# Altium project GrippersTorpedoModule_V1_OKON.PrjPCB
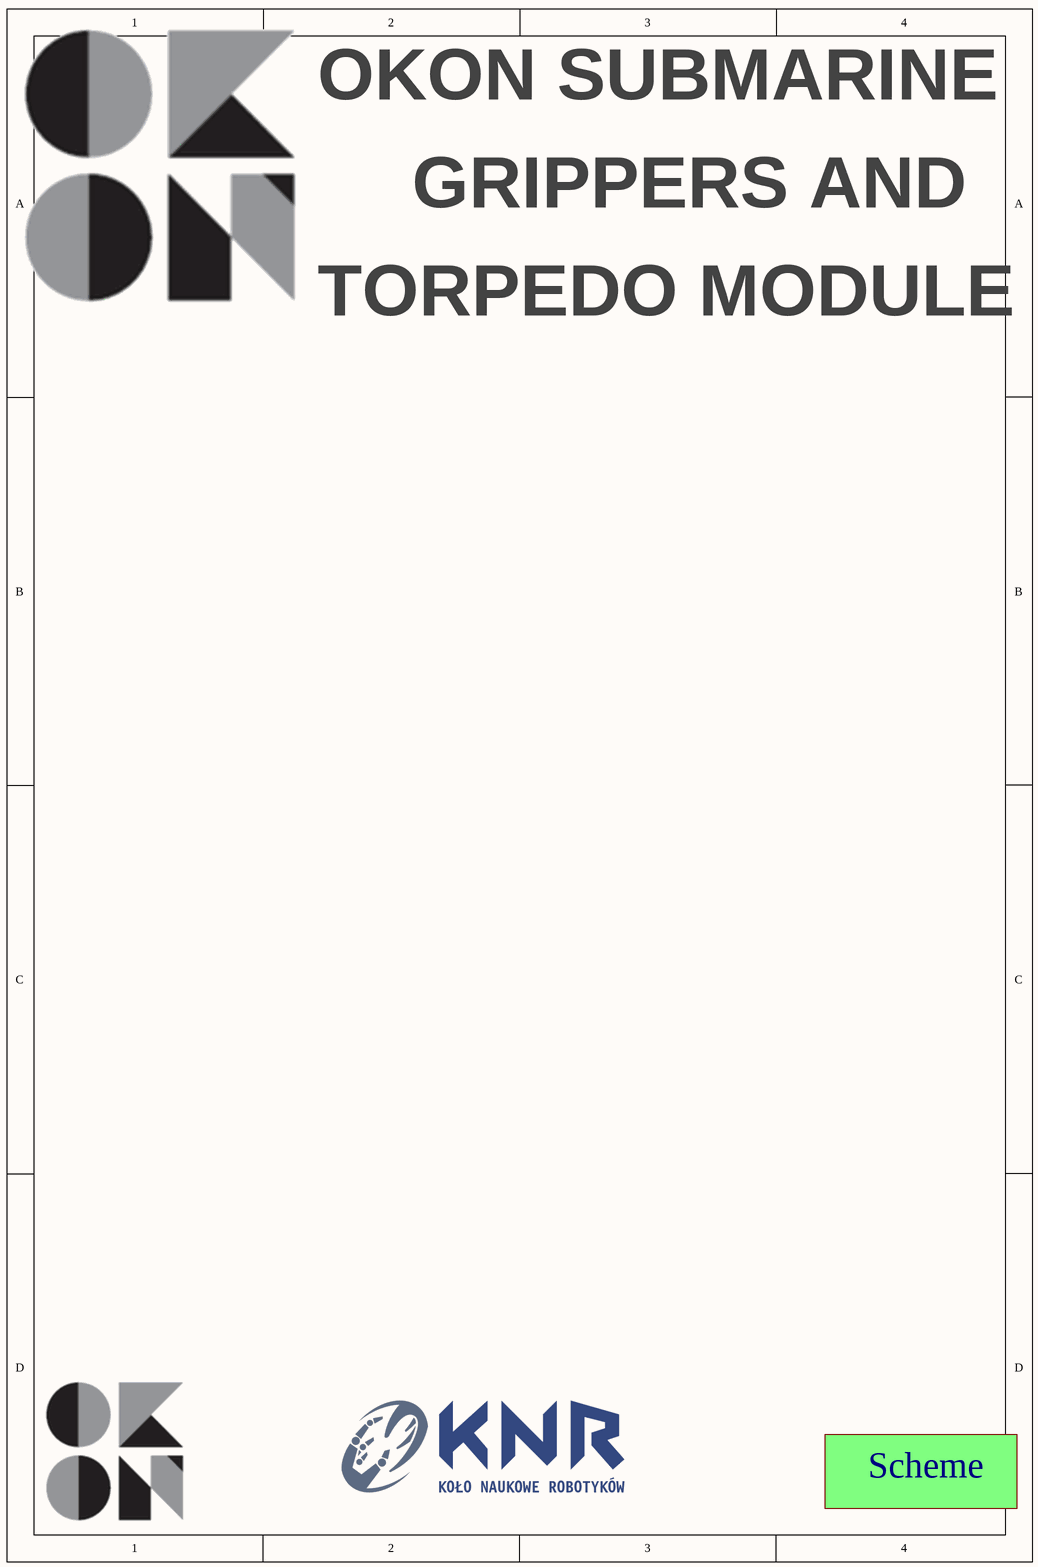
[diagram p0: GTM_OKON.SchDoc]
20 sheets, 150 parts. Net scope: flat (ports and power ports of the same name join across sheets).
Sheets:
  GTM_OKON.SchDoc
    Designator = GTM_Connectors.SchDoc
      Main Board = GTM_MainBoard.SchDoc
        MCU = GTM_MCU.SchDoc
        Controled LEDs = GTM_MCUcontrolledLEDs.SchDoc
        Fototransistor's  Circuits = GTM_BallGrippersCircuits.SchDoc
      Left Jaw Gripper = GTM_LeftJawGrippersMotorsConnectors.SchDoc
      Right Jaw Gripper = GTM_RightJawGrippersMotorConnector.SchDoc
      Torpedo = GTM_TorpedoModuleControlConnector.SchDoc
      Power Circuits(LDO) = GTM_PowerCircuits.SchDoc
      Fototransistors Connectors = GTM_BallGrippersFototransistorsConnectors.SchDoc
      Fotodiodes Connectors = GTM_BallGrippersDiodesConnectors.SchDoc
      Ball Gripper Motor Connector = GTM_BallGrippersMotorConnector.SchDoc
      UART = GTM_UARTconnector.SchDoc
      CAN = GTM_CANconnector.SchDoc
      I2C = GTM_I2Cconnector.SchDoc
      SPI = GTM_SPIconnector.SchDoc
      Free Pins = GTM_FreePinsHeaders.SchDoc
      Programming = GTM_ProgrammingConnector.SchDoc
      Power Connector = GTM_PowerConnector.SchDoc

## Sheet GTM_OKON.SchDoc: Wprowadź Tytuł
size 193 x 292 mm; CheckedBy: Wprowadź sprawdzającego; DrawnBy: Wprowadź autora; Organization: Koło Naukowe Robotyków; Address1: Nowowiejska 24; Address2: 00-001; Address3: Wraszawa; Address4: Polska; Revision: Numer; Nazwa Arkusza: Wpisz nazwę arkusza; ProjectName: Nazwa Projektu

### Sub-sheets
Designator = GTM_Connectors.SchDoc: no entries

### Notes on the sheet
- OKON SUBMARINE
- GRIPPERS AND
- TORPEDO MODULE
- Scheme
- Title
- Size:
- Date:
- A4
- Number:
- Time:
- Revision:
- Sheet
- of
- File:

## Sheet GTM_Connectors.SchDoc: GTM Scheme
size A4; CompanyName: Koło Naukowe Robotyków; DrawnBy: Tadeusz Golczyk; Address1: Nowowiejska 24; Address2: 00-001; Address3: Warszawa; DocumentNumber: 1
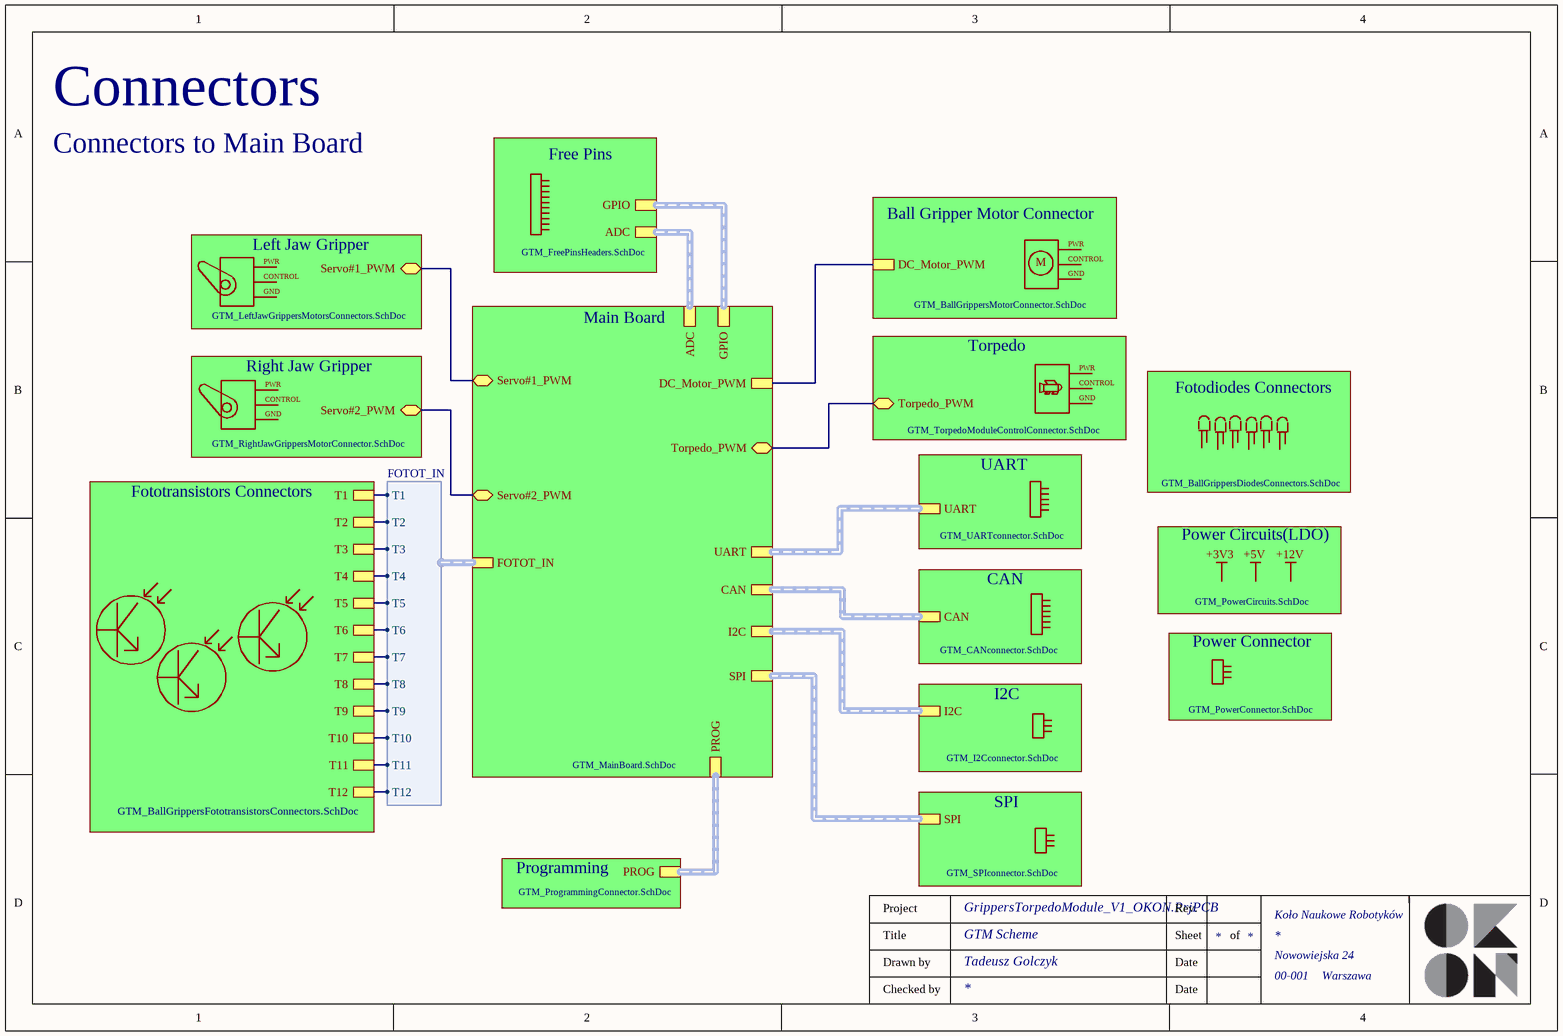
[diagram p1: GTM_Connectors.SchDoc]

### Sub-sheets
Ball Gripper Motor Connector = GTM_BallGrippersMotorConnector.SchDoc: DC_Motor_PWM
CAN = GTM_CANconnector.SchDoc: CAN
Fotodiodes Connectors = GTM_BallGrippersDiodesConnectors.SchDoc: no entries
Fototransistors Connectors = GTM_BallGrippersFototransistorsConnectors.SchDoc: T1, T2, T3, T4, T5, T6, T7, T8, T9, T10, T11, T12
Free Pins = GTM_FreePinsHeaders.SchDoc: ADC, GPIO
I2C = GTM_I2Cconnector.SchDoc: I2C
Left Jaw Gripper = GTM_LeftJawGrippersMotorsConnectors.SchDoc: Servo#1_PWM (bidir)
Main Board = GTM_MainBoard.SchDoc: FOTOT_IN (harness FOTOT_IN), Servo#2_PWM (bidir), Servo#1_PWM (bidir), ADC, GPIO, PROG, DC_Motor_PWM, Torpedo_PWM (bidir), UART, CAN, I2C, SPI
Power Circuits(LDO) = GTM_PowerCircuits.SchDoc: no entries
Power Connector = GTM_PowerConnector.SchDoc: no entries
Programming = GTM_ProgrammingConnector.SchDoc: PROG
Right Jaw Gripper = GTM_RightJawGrippersMotorConnector.SchDoc: Servo#2_PWM (bidir)
SPI = GTM_SPIconnector.SchDoc: SPI
Torpedo = GTM_TorpedoModuleControlConnector.SchDoc: Torpedo_PWM (bidir)
UART = GTM_UARTconnector.SchDoc: UART

### Harnesses
FOTOT_IN: T1, T2, T3, T4, T5, T6, T7, T8, T9, T10, T11, T12

### Nets
(unnamed): sheet Main Board/Servo#2_PWM, sheet Right Jaw Gripper/Servo#2_PWM
(unnamed): sheet Main Board/Servo#1_PWM, sheet Left Jaw Gripper/Servo#1_PWM
(unnamed): sheet Main Board/DC_Motor_PWM, sheet Ball Gripper Motor Connector/DC_Motor_PWM
(unnamed): sheet Main Board/Torpedo_PWM, sheet Torpedo/Torpedo_PWM
(unnamed): sheet Fototransistors Connectors/T1, sheet Main Board/FOTOT_IN.T1
(unnamed): sheet Fototransistors Connectors/T2, sheet Main Board/FOTOT_IN.T2
(unnamed): sheet Fototransistors Connectors/T3, sheet Main Board/FOTOT_IN.T3
(unnamed): sheet Fototransistors Connectors/T4, sheet Main Board/FOTOT_IN.T4
(unnamed): sheet Fototransistors Connectors/T5, sheet Main Board/FOTOT_IN.T5
(unnamed): sheet Fototransistors Connectors/T6, sheet Main Board/FOTOT_IN.T6
(unnamed): sheet Fototransistors Connectors/T7, sheet Main Board/FOTOT_IN.T7
(unnamed): sheet Fototransistors Connectors/T8, sheet Main Board/FOTOT_IN.T8
(unnamed): sheet Fototransistors Connectors/T9, sheet Main Board/FOTOT_IN.T9
(unnamed): sheet Fototransistors Connectors/T10, sheet Main Board/FOTOT_IN.T10
(unnamed): sheet Fototransistors Connectors/T11, sheet Main Board/FOTOT_IN.T11
(unnamed): sheet Fototransistors Connectors/T12, sheet Main Board/FOTOT_IN.T12

### Buses and harness runs
harness sheet CAN/CAN = sheet Main Board/CAN
harness sheet Free Pins/ADC = sheet Main Board/ADC
harness sheet Free Pins/GPIO = sheet Main Board/GPIO
harness sheet I2C/I2C = sheet Main Board/I2C
harness sheet Main Board/PROG = sheet Programming/PROG
harness sheet Main Board/SPI = sheet SPI/SPI
harness sheet Main Board/UART = sheet UART/UART

### Notes on the sheet
- Connectors
- Connectors to Main Board
- PWR
- CONTROL
- GND
- M
- +3V3
- +5V
- +12V
- Project
- Rev.
- Title
- Drawn by
- Date
- Sheet
- of
- Checked by

## Sheet GTM_MainBoard.SchDoc
size A4
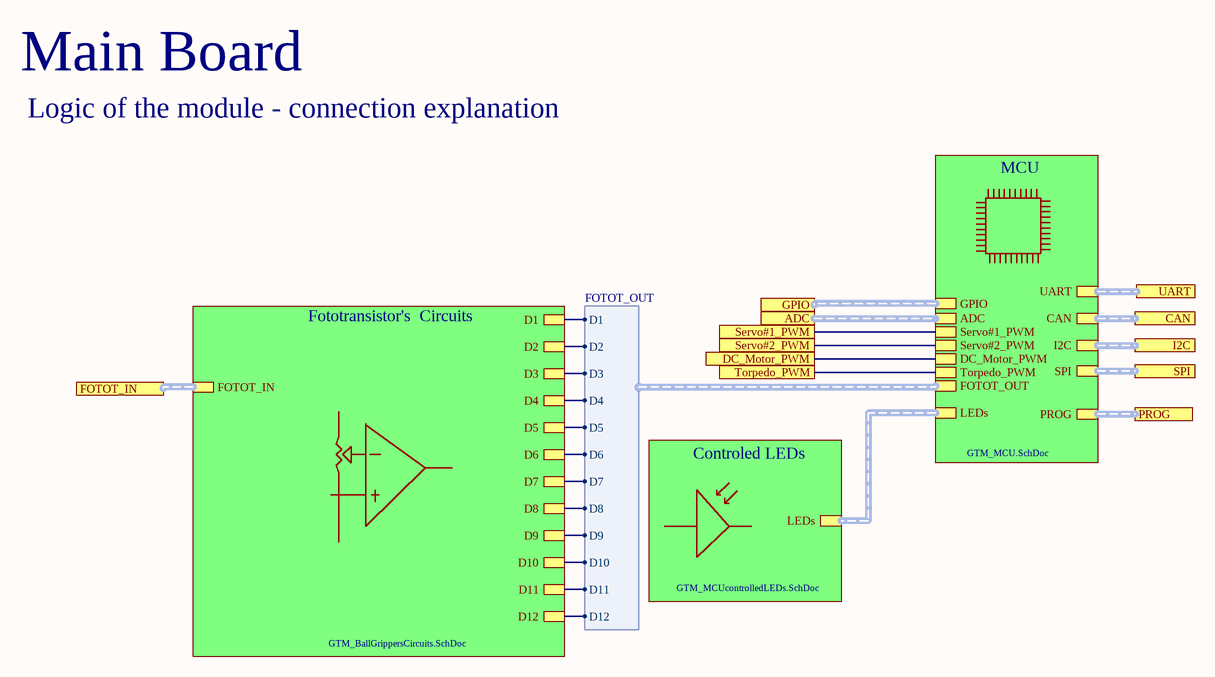
[diagram p2: GTM_MainBoard.SchDoc]

### Sub-sheets
Controled LEDs = GTM_MCUcontrolledLEDs.SchDoc: LEDs
Fototransistor's  Circuits = GTM_BallGrippersCircuits.SchDoc: FOTOT_IN (harness Harness), D1, D2, D3, D4, D5, D6, D7, D8, D9, D10, D11, D12
MCU = GTM_MCU.SchDoc: ADC, GPIO, UART, CAN, I2C, SPI, PROG, LEDs, Servo#1_PWM, Servo#2_PWM, DC_Motor_PWM, Torpedo_PWM, FOTOT_OUT (harness FOTOT_OUT)

### Ports
ADC, CAN, DC_Motor_PWM, FOTOT_IN, GPIO, I2C, PROG, Servo#1_PWM, Servo#2_PWM, SPI, Torpedo_PWM, UART

### Harnesses
FOTOT_OUT: D1, D2, D3, D4, D5, D6, D7, D8, D9, D10, D11, D12

### Nets
DC_Motor_PWM: port DC_Motor_PWM, sheet MCU/DC_Motor_PWM
Servo#1_PWM: port Servo#1_PWM, sheet MCU/Servo#1_PWM
Servo#2_PWM: port Servo#2_PWM, sheet MCU/Servo#2_PWM
Torpedo_PWM: port Torpedo_PWM, sheet MCU/Torpedo_PWM
(unnamed): sheet Fototransistor's  Circuits/D1, sheet MCU/FOTOT_OUT.D1
(unnamed): sheet Fototransistor's  Circuits/D2, sheet MCU/FOTOT_OUT.D2
(unnamed): sheet Fototransistor's  Circuits/D3, sheet MCU/FOTOT_OUT.D3
(unnamed): sheet Fototransistor's  Circuits/D4, sheet MCU/FOTOT_OUT.D4
(unnamed): sheet Fototransistor's  Circuits/D5, sheet MCU/FOTOT_OUT.D5
(unnamed): sheet Fototransistor's  Circuits/D6, sheet MCU/FOTOT_OUT.D6
(unnamed): sheet Fototransistor's  Circuits/D7, sheet MCU/FOTOT_OUT.D7
(unnamed): sheet Fototransistor's  Circuits/D8, sheet MCU/FOTOT_OUT.D8
(unnamed): sheet Fototransistor's  Circuits/D9, sheet MCU/FOTOT_OUT.D9
(unnamed): sheet Fototransistor's  Circuits/D10, sheet MCU/FOTOT_OUT.D10
(unnamed): sheet Fototransistor's  Circuits/D11, sheet MCU/FOTOT_OUT.D11
(unnamed): sheet Fototransistor's  Circuits/D12, sheet MCU/FOTOT_OUT.D12

### Buses and harness runs
harness port ADC = sheet MCU/ADC
harness port CAN = sheet MCU/CAN
harness port FOTOT_IN = sheet Fototransistor's  Circuits/FOTOT_IN
harness port GPIO = sheet MCU/GPIO
harness port I2C = sheet MCU/I2C
harness port PROG = sheet MCU/PROG
harness port SPI = sheet MCU/SPI
harness port UART = sheet MCU/UART
harness sheet Controled LEDs/LEDs = sheet MCU/LEDs

### Notes on the sheet
- Main Board
- Logic of the module - connection explanation
- Project
- Rev.
- Title
- Drawn by
- Date
- Sheet
- of
- Checked by

## Sheet GTM_MCU.SchDoc
size A4
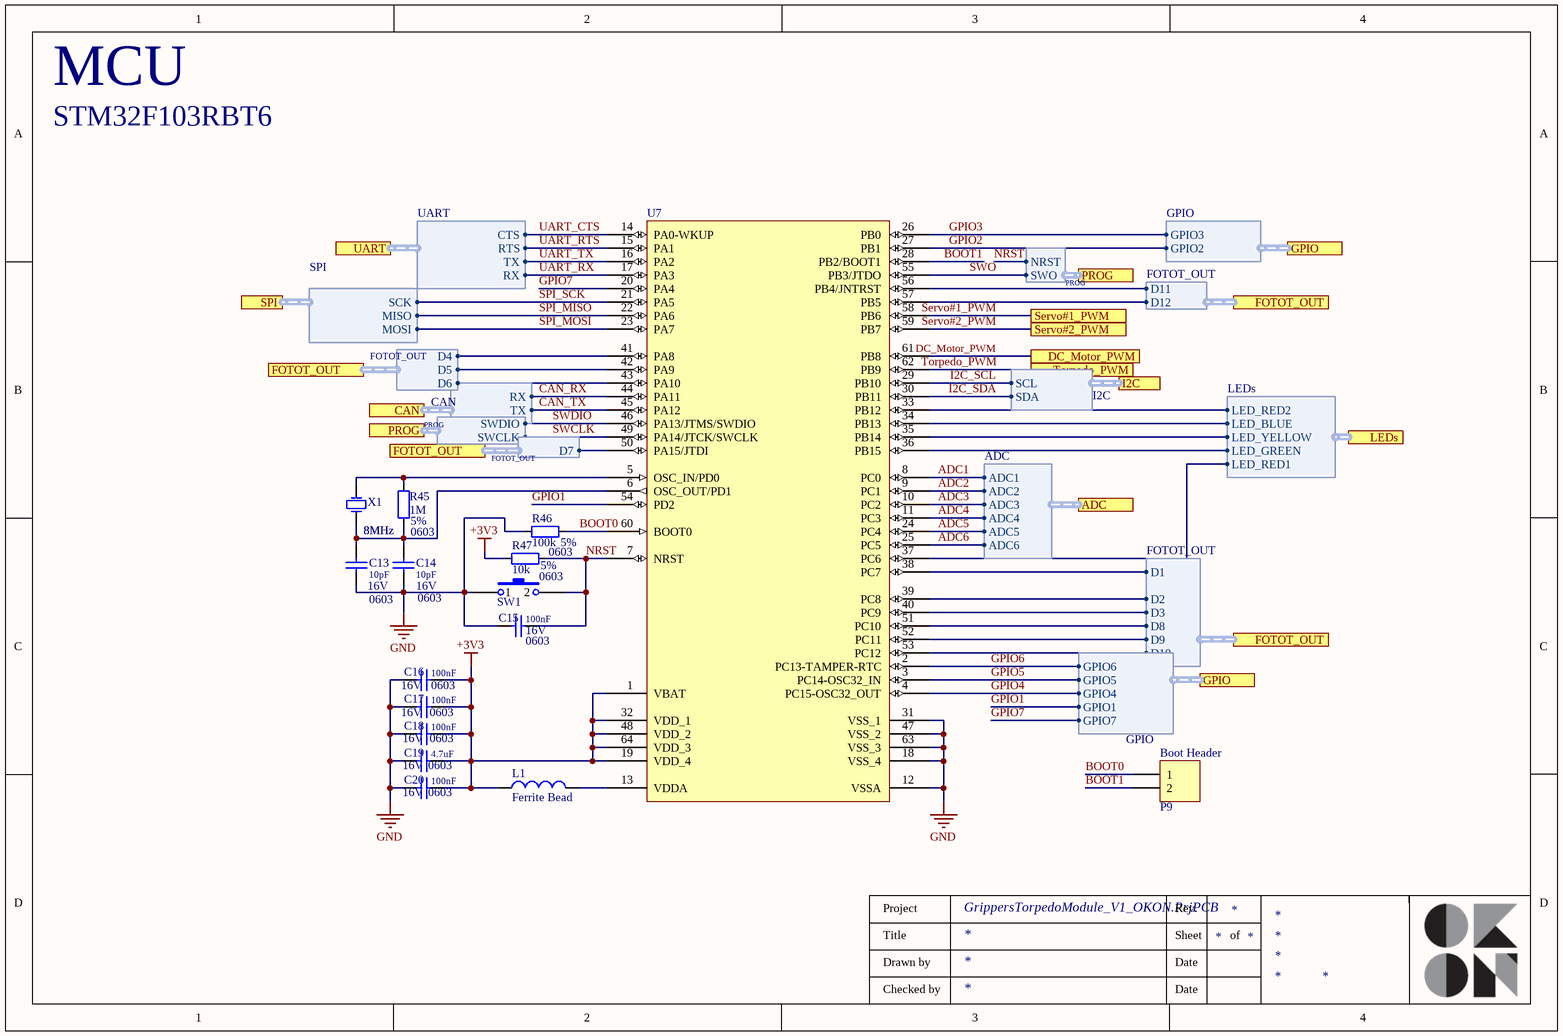
[diagram p3: GTM_MCU.SchDoc]

### Parts
C13  value 10pF  Capacity: 16V  Package: 0603  [0603_CAP]  (hidden comment: Cap)
C14  value 10pF  Capacity: 16V  Package: 0603  [0603_CAP]  (hidden comment: Cap)
C15  value 100nF  Capacity: 16V  Package: 0603  [0603_CAP]  (hidden comment: Cap)
C16  value 100nF  Capacity: 16V  Package: 0603  [0603_CAP]  (hidden comment: Cap)
C17  value 100nF  Capacity: 16V  Package: 0603  [0603_CAP]  (hidden comment: Cap)
C18  value 100nF  Capacity: 16V  Package: 0603  [0603_CAP]  (hidden comment: Cap)
C19  value 4.7uF  Capacity: 16V  Package: 0603  [0603_CAP]  (hidden comment: Cap)
C20  value 100nF  Capacity: 16V  Package: 0603  [0603_CAP]  (hidden comment: Cap)
L1  Ferrite Bead  [DO5040]
P9  Boot Header  [HDR1X2]
R45  Tolerance: 5%  [0603]  (hidden comment: 1M)
R46  Tolerance: 5%  [0603]  (hidden comment: 100k)
R47  Tolerance: 5%  [0603]  (hidden comment: 10k)
SW1  Micro_Switch  [Tact 34N-F]  (value not drawn)
U7  STM32F103RBT6  [LQFP64_L]  (value not drawn)
X1  8MHz  [HC49/4H_SMX]

### Ports
ADC (harness ADC), CAN (harness CAN), DC_Motor_PWM, FOTOT_OUT (harness FOTOT_OUT), GPIO (harness GPIO), I2C (harness I2C), LEDs (harness LEDs), PROG (harness PROG), Servo#1_PWM, Servo#2_PWM, SPI (harness SPI), Torpedo_PWM, UART (harness UART)

### Harnesses
LEDs: LED_RED1, LED_GREEN, LED_YELLOW, LED_BLUE, LED_RED2
FOTOT_OUT: D1, D2, D3, D8, D9, D10
UART: CTS, RTS, TX, RX
SPI: SCK, MISO, MOSI
CAN: RX, TX
I2C: SCL, SDA
ADC: ADC1, ADC2, ADC3, ADC4, ADC5, ADC6
PROG: SWCLK, SWDIO
PROG: SWO, NRST
GPIO: GPIO4, GPIO5, GPIO6, GPIO1, GPIO7
FOTOT_OUT: D4, D5, D6
FOTOT_OUT: D7
FOTOT_OUT: D12, D11
GPIO: GPIO2, GPIO3

### Nets
+3V3: C16.2 C17.2 C18.2 C19.2 C20.2 L1.1 R47.2 U7.1(VBAT) U7.19(VDD_4) U7.32(VDD_1) U7.48(VDD_2) U7.64(VDD_3)
GND: C13.1 C14.1 C15.1 C16.1 C17.1 C18.1 C19.1 C20.1 R46.2 SW1.1 U7.12(VSSA) U7.18(VSS_4) U7.31(VSS_1) U7.47(VSS_2) U7.63(VSS_3)
ADC1: U7.8(PC0) ; port ADC.ADC1
ADC2: U7.9(PC1) ; port ADC.ADC2
ADC3: U7.10(PC2) ; port ADC.ADC3
ADC4: U7.11(PC3) ; port ADC.ADC4
ADC5: U7.24(PC4) ; port ADC.ADC5
ADC6: U7.25(PC5) ; port ADC.ADC6
BOOT0: P9.1 R46.1 U7.60(BOOT0)
BOOT1: P9.2 U7.28(PB2/BOOT1)
CAN_RX: U7.44(PA11) ; port CAN.RX
CAN_TX: U7.45(PA12) ; port CAN.TX
DC_Motor_PWM: U7.61(PB8) ; port DC_Motor_PWM
GPIO1: U7.54(PD2) ; port GPIO.GPIO1
GPIO2: U7.27(PB1) ; port GPIO.GPIO2
GPIO3: U7.26(PB0) ; port GPIO.GPIO3
GPIO4: U7.4(PC15-OSC32_OUT) ; port GPIO.GPIO4
GPIO5: U7.3(PC14-OSC32_IN) ; port GPIO.GPIO5
GPIO6: U7.2(PC13-TAMPER-RTC) ; port GPIO.GPIO6
GPIO7: U7.20(PA4) ; port GPIO.GPIO7
I2C_SCL: U7.29(PB10) ; port I2C.SCL
I2C_SDA: U7.30(PB11) ; port I2C.SDA
NRST: C15.2 R47.1 SW1.2 U7.7(NRST) ; port PROG.NRST
Servo#1_PWM: U7.58(PB6) ; port Servo#1_PWM
Servo#2_PWM: U7.59(PB7) ; port Servo#2_PWM
SPI_MISO: U7.22(PA6) ; port SPI.MISO
SPI_MOSI: U7.23(PA7) ; port SPI.MOSI
SPI_SCK: U7.21(PA5) ; port SPI.SCK
SWCLK: U7.49(PA14/JTCK/SWCLK) ; port PROG.SWCLK
SWDIO: U7.46(PA13/JTMS/SWDIO) ; port PROG.SWDIO
SWO: U7.55(PB3/JTDO) ; port PROG.SWO
Torpedo_PWM: U7.62(PB9) ; port Torpedo_PWM
UART_CTS: U7.14(PA0-WKUP) ; port UART.CTS
UART_RTS: U7.15(PA1) ; port UART.RTS
UART_RX: U7.17(PA3) ; port UART.RX
UART_TX: U7.16(PA2) ; port UART.TX
NetC13_2: C13.2 C14.2 R45.1 U7.6(OSC_OUT/PD1) X1.1(OSC1)
NetL1_2: L1.2 U7.13(VDDA)
NetR45_2: R45.2 U7.5(OSC_IN/PD0) X1.2(OSC2)
NetR48_1: U7.37(PC6) ; port LEDs.LED_RED1
NetR49_1: U7.36(PB15) ; port LEDs.LED_GREEN
NetR50_1: U7.35(PB14) ; port LEDs.LED_YELLOW
NetR51_1: U7.34(PB13) ; port LEDs.LED_BLUE
NetR52_1: U7.33(PB12) ; port LEDs.LED_RED2
NetU7_38: U7.38(PC7) ; port FOTOT_OUT.D1
NetU7_39: U7.39(PC8) ; port FOTOT_OUT.D2
NetU7_40: U7.40(PC9) ; port FOTOT_OUT.D3
NetU7_41: U7.41(PA8) ; port FOTOT_OUT.D4
NetU7_42: U7.42(PA9) ; port FOTOT_OUT.D5
NetU7_43: U7.43(PA10) ; port FOTOT_OUT.D6
NetU7_50: U7.50(PA15/JTDI) ; port FOTOT_OUT.D7
NetU7_51: U7.51(PC10) ; port FOTOT_OUT.D8
NetU7_52: U7.52(PC11) ; port FOTOT_OUT.D9
NetU7_53: U7.53(PC12) ; port FOTOT_OUT.D10
NetU7_56: U7.56(PB4/JNTRST) ; port FOTOT_OUT.D11
NetU7_57: U7.57(PB5) ; port FOTOT_OUT.D12

### Notes on the sheet
- MCU
- STM32F103RBT6
- Project
- Rev.
- Title
- Drawn by
- Date
- Sheet
- of
- Checked by

### Library data of the parts
C13-C20 = Cap: Ceramic capacitor; Unit Price1: *; Unit Price2: *
L1 = Inductor: DO5040H-103; Code_IEC: 1005; Published: 8-Jun-2000; LatestRevisionDate: 29-May-2009; LatestRevisionNote: IPC-7351 Footprint Added.; PackageReference: 0402-A; Publisher: Altium Limited; PackageDescription: Chip Inductor; Code_JEITA: 0402
P9 = HDR1X2: Header, 2-Pin; LatestRevisionDate: 17-Jul-2002; LatestRevisionNote: Re-released for DXP Platform.; Publisher: Altium Limited
R45-R47 = RES: Resistior; Package: 0603
  R45: Value: 1M
  R46: Value: 100k
  R47: Value: 10k
SW1 = Micro_Switch: Switch; Published: 24-Mar-1999; LatestRevisionDate: 17-Jul-2002; LatestRevisionNote: Re-released for DXP Platform.; PackageReference: SPST-2; Publisher: Altium Limited
U7 = STM32F103RBT6: STM32 ARM-based 32-bit; Published: 30-May-2008; DatasheetVersion: rev6, Mar-2008; PackageVersion: Mar-2008; PackageReference: LQFP64; Publisher: Altium Limited; PackageDescription: 64-Pin Low-Profile Quad Flat Pack, 10 x 10 mm Body, 0.5 mm Pitch (LQFP64); ComponentLink1Description: Manufacturer Link; ComponentLink1URL: www.st.com/stm32; ComponentLink2Description: Datasheet; ComponentLink2URL: http://www.st.com/stonline/products/literature/ds/13587.pdf
X1 = XTAL: Oscillator; Unit Price1: *; Unit Price2: *; Value: 8MHz

## Sheet GTM_MCUcontrolledLEDs.SchDoc
size A4
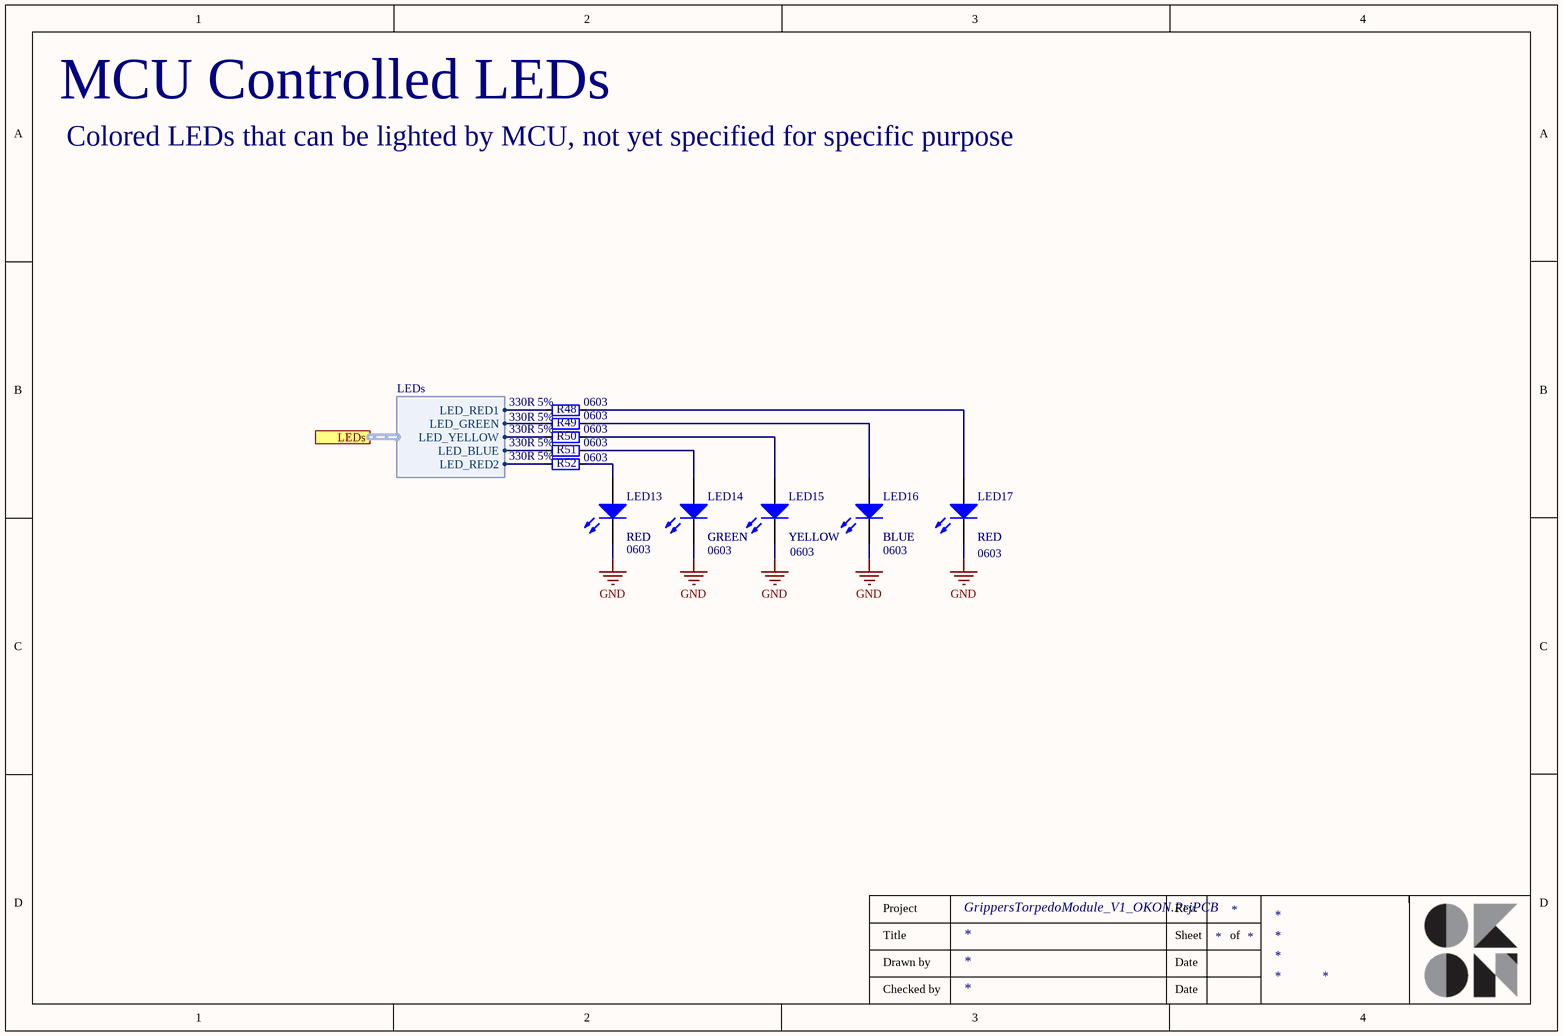
[diagram p4: GTM_MCUcontrolledLEDs.SchDoc]

### Parts
LED13  RED  Package: 0603  [LED_THT_RED]
LED14  GREEN  Package: 0603  [LED_THT_YELLOW]
LED15  YELLOW  Package: 0603  [LED_THT_GREEN]
LED16  BLUE  Package: 0603  [LED_THT_BLUE]
LED17  RED  Package: 0603  [LED_THT_RED]
R48  Tolerance: 5%  [0603]  (hidden comment: 330R)
R49  Tolerance: 5%  [0603]  (hidden comment: 330R)
R50  Tolerance: 5%  [0603]  (hidden comment: 330R)
R51  Tolerance: 5%  [0603]  (hidden comment: 330R)
R52  Tolerance: 5%  [0603]  (hidden comment: 330R)

### Ports
LEDs (harness LEDs)

### Harnesses
LEDs: LED_RED1, LED_GREEN, LED_YELLOW, LED_BLUE, LED_RED2

### Nets
GND: LED13.2(K) LED14.2(K) LED15.2(K) LED16.2(K) LED17.2(K)
NetLED13_1: LED13.1(A) R52.2
NetLED14_1: LED14.1(A) R51.2
NetLED15_1: LED15.1(A) R50.2
NetLED16_1: LED16.1(A) R49.2
NetLED17_1: LED17.1(A) R48.2
NetR48_1: R48.1 ; port LEDs.LED_RED1
NetR49_1: R49.1 ; port LEDs.LED_GREEN
NetR50_1: R50.1 ; port LEDs.LED_YELLOW
NetR51_1: R51.1 ; port LEDs.LED_BLUE
NetR52_1: R52.1 ; port LEDs.LED_RED2

### Notes on the sheet
- MCU Controlled LEDs
- Colored LEDs that can be lighted by MCU, not yet specified for specific purpose
- Project
- Rev.
- Title
- Drawn by
- Date
- Sheet
- of
- Checked by

### Library data of the parts
LED13-LED17 = LED: Light-emitting diode
  LED13 LED17: COLOR: RED
  LED14: COLOR: GREEN
  LED15: COLOR: YELLOW
  LED16: COLOR: BLUE
R48-R52 = RES: Resistior; Value: 330R; Package: 0603

## Sheet GTM_BallGrippersCircuits.SchDoc
size A3
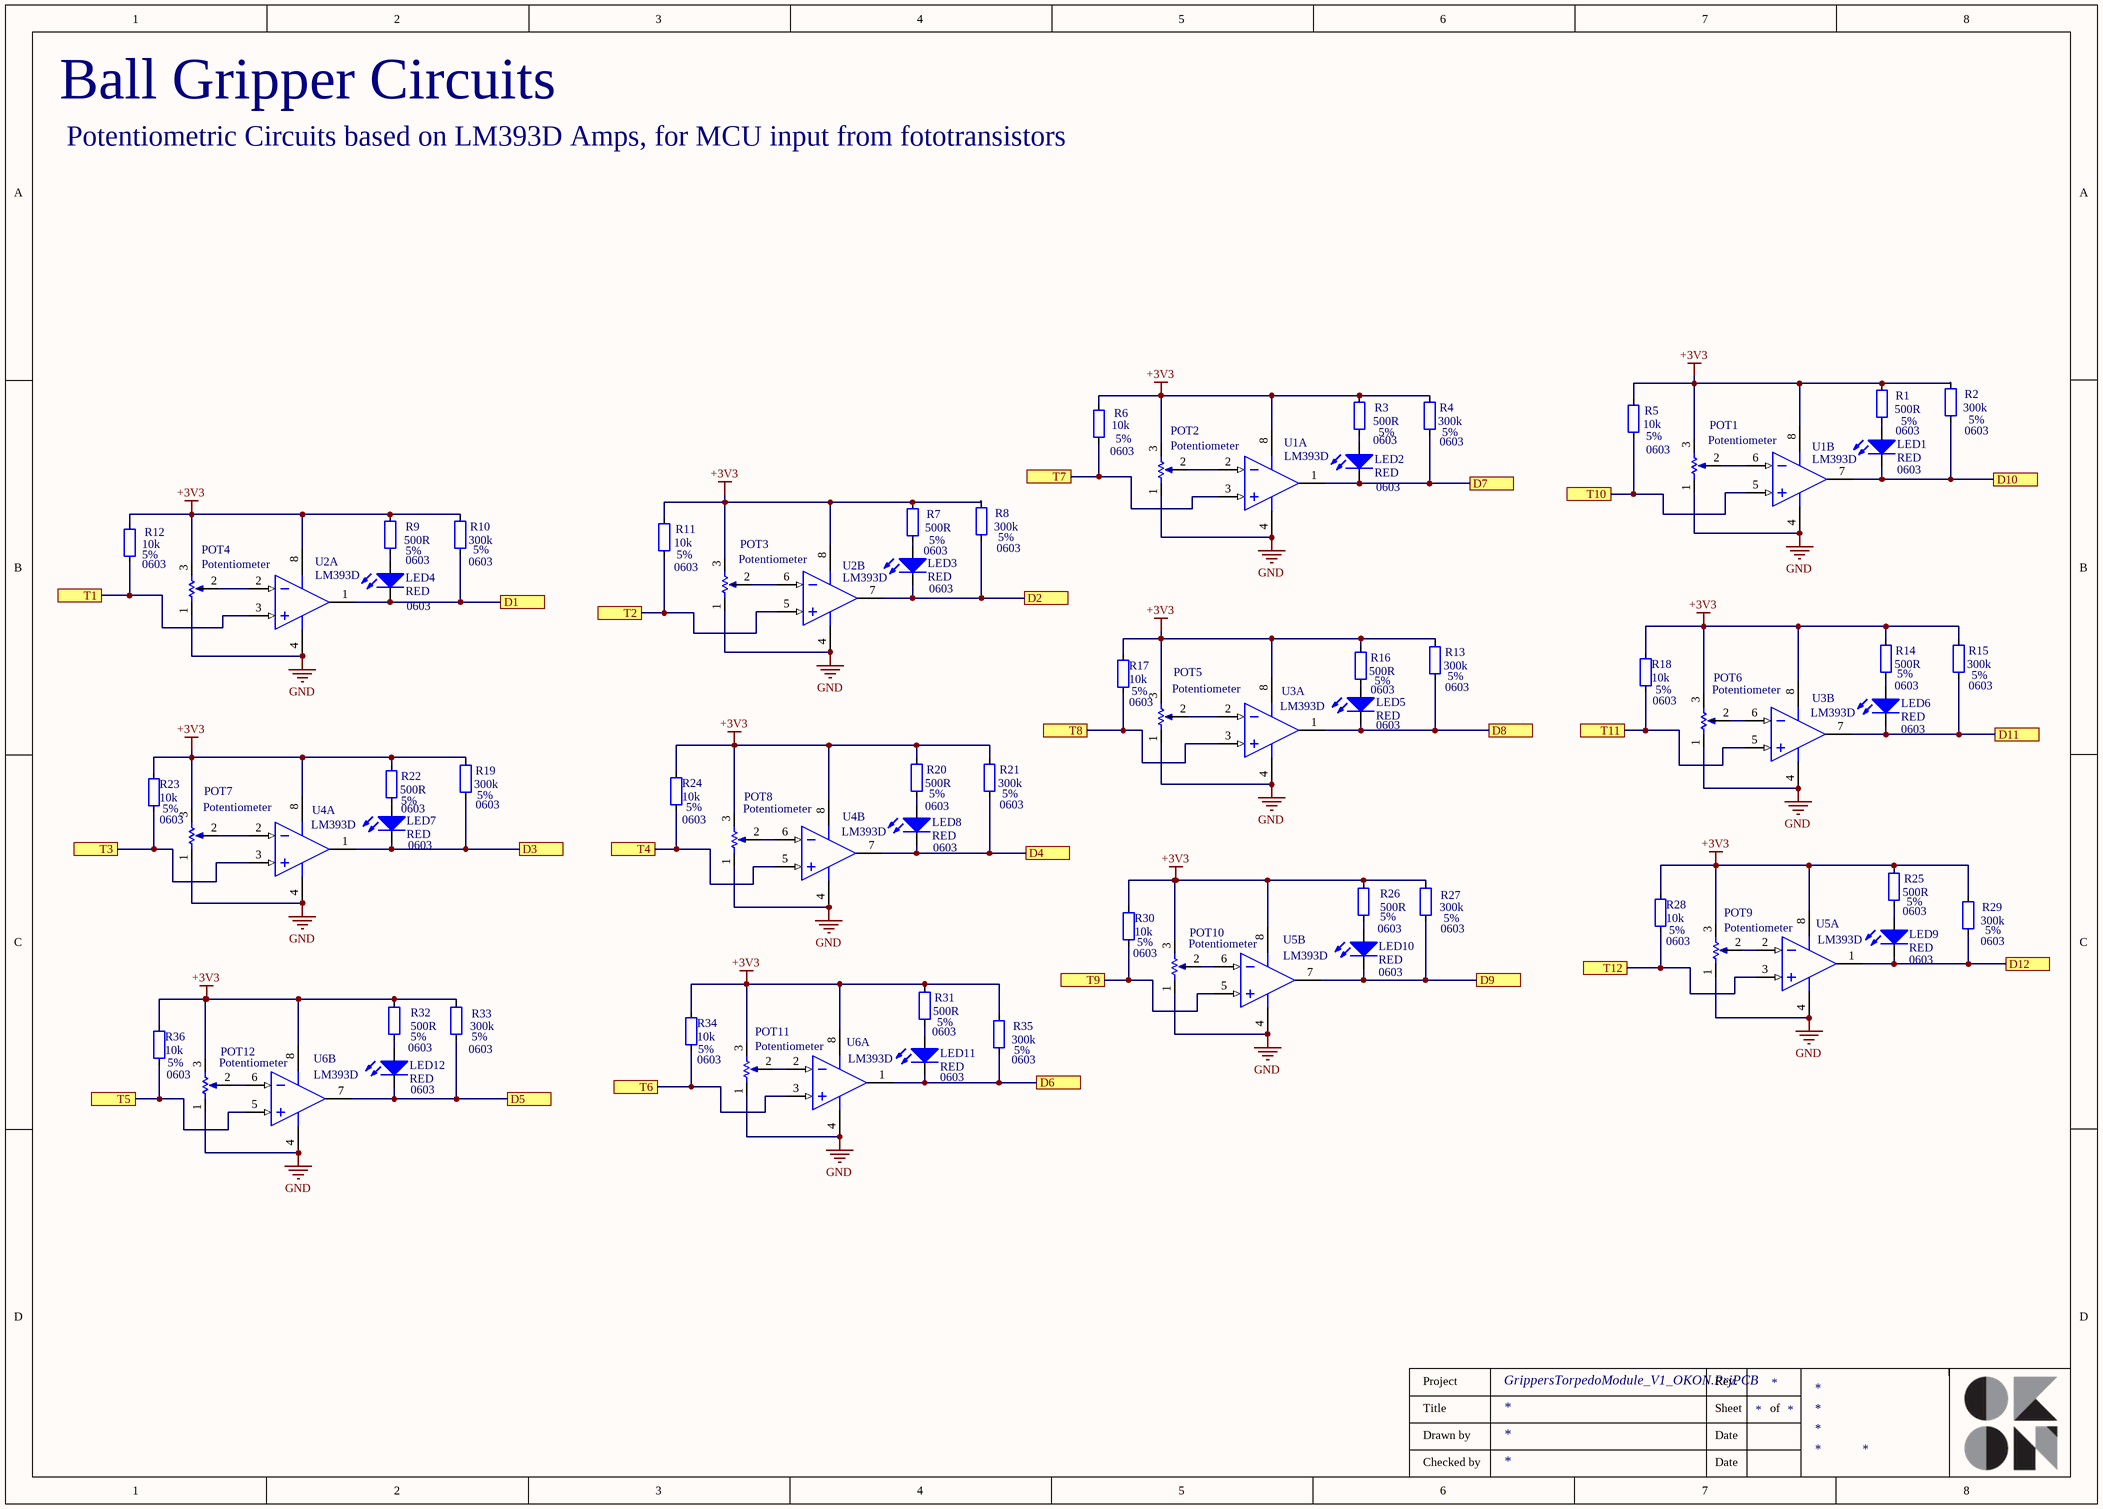
[diagram p5: GTM_BallGrippersCircuits.SchDoc]

### Parts
LED1  RED  Package: 0603  [0603_led_red]
LED2  RED  Package: 0603  [0603_led_red]
LED3  RED  Package: 0603  [0603_led_red]
LED4  RED  Package: 0603  [0603_led_red]
LED5  RED  Package: 0603  [0603_led_red]
LED6  RED  Package: 0603  [0603_led_red]
LED7  RED  Package: 0603  [0603_led_red]
LED8  RED  Package: 0603  [0603_led_red]
LED9  RED  Package: 0603  [0603_led_red]
LED10  RED  Package: 0603  [0603_led_red]
LED11  RED  Package: 0603  [0603_led_red]
LED12  RED  Package: 0603  [0603_led_red]
POT1  Potentiometer  [Pot_3296]
POT2  Potentiometer  [Pot_3296]
POT3  Potentiometer  [Pot_3296]
POT4  Potentiometer  [Pot_3296]
POT5  Potentiometer  [Pot_3296]
POT6  Potentiometer  [Pot_3296]
POT7  Potentiometer  [Pot_3296]
POT8  Potentiometer  [Pot_3296]
POT9  Potentiometer  [Pot_3296]
POT10  Potentiometer  [Pot_3296]
POT11  Potentiometer  [Pot_3296]
POT12  Potentiometer  [Pot_3296]
R1  Tolerance: 5%  [0603]  (hidden comment: 500R)
R2  Tolerance: 5%  [0603]  (hidden comment: 300k)
R3  Tolerance: 5%  [0603]  (hidden comment: 500R)
R4  Tolerance: 5%  [0603]  (hidden comment: 300k)
R5  Tolerance: 5%  [0603]  (hidden comment: 10k)
R6  Tolerance: 5%  [0603]  (hidden comment: 10k)
R7  Tolerance: 5%  [0603]  (hidden comment: 500R)
R8  Tolerance: 5%  [0603]  (hidden comment: 300k)
R9  Tolerance: 5%  [0603]  (hidden comment: 500R)
R10  Tolerance: 5%  [0603]  (hidden comment: 300k)
R11  Tolerance: 5%  [0603]  (hidden comment: 10k)
R12  Tolerance: 5%  [0603]  (hidden comment: 10k)
R13  Tolerance: 5%  [0603]  (hidden comment: 300k)
R14  Tolerance: 5%  [0603]  (hidden comment: 500R)
R15  Tolerance: 5%  [0603]  (hidden comment: 300k)
R16  Tolerance: 5%  [0603]  (hidden comment: 500R)
R17  Tolerance: 5%  [0603]  (hidden comment: 10k)
R18  Tolerance: 5%  [0603]  (hidden comment: 10k)
R19  Tolerance: 5%  [0603]  (hidden comment: 300k)
R20  Tolerance: 5%  [0603]  (hidden comment: 500R)
R21  Tolerance: 5%  [0603]  (hidden comment: 300k)
R22  Tolerance: 5%  [0603]  (hidden comment: 500R)
R23  Tolerance: 5%  [0603]  (hidden comment: 10k)
R24  Tolerance: 5%  [0603]  (hidden comment: 10k)
R25  Tolerance: 5%  [0603]  (hidden comment: 500R)
R26  Tolerance: 5%  [0603]  (hidden comment: 500R)
R27  Tolerance: 5%  [0603]  (hidden comment: 300k)
R28  Tolerance: 5%  [0603]  (hidden comment: 10k)
R29  Tolerance: 5%  [0603]  (hidden comment: 300k)
R30  Tolerance: 5%  [0603]  (hidden comment: 10k)
R31  Tolerance: 5%  [0603]  (hidden comment: 500R)
R32  Tolerance: 5%  [0603]  (hidden comment: 500R)
R33  Tolerance: 5%  [0603]  (hidden comment: 300k)
R34  Tolerance: 5%  [0603]  (hidden comment: 10k)
R35  Tolerance: 5%  [0603]  (hidden comment: 300k)
R36  Tolerance: 5%  [0603]  (hidden comment: 10k)
U1  LM393D  [SO8_N]  (parts A,B of 2)
U2  LM393D  [SO8_N]  (parts A,B of 2)
U3  LM393D  [SO8_N]  (parts A,B of 2)
U4  LM393D  [SO8_N]  (parts A,B of 2)
U5  LM393D  [SO8_N]  (parts A,B of 2)
U6  LM393D  [SO8_N]  (parts A,B of 2)

### Ports
D1, D2, D3, D4, D5, D6, D7, D8, D9, D10, D11, D12, T1, T2, T3, T4, T5, T6, T7, T8, T9, T10, T11, T12

### Nets
+3V3: POT1.3 POT2.3 POT3.3 POT4.3 POT5.3 POT6.3 POT7.3 POT8.3 POT9.3 POT10.3 POT11.3 POT12.3 R1.2 R2.2 R3.2 R4.2 R5.2 R6.2 R7.2 R8.2 R9.2 R10.2 R11.2 R12.2 R13.2 R14.2 R15.2 R16.2 R17.2 R18.2 R19.2 R20.2 R21.2 R22.2 R23.2 R24.2 R25.2 R26.2 R27.2 R28.2 R29.2 R30.2 R31.2 R32.2 R33.2 R34.2 R35.2 R36.2 U1.8(V+) U2.8(V+) U3.8(V+) U4.8(V+) U5.8(V+) U6.8(V+)
GND: POT1.1 POT2.1 POT3.1 POT4.1 POT5.1 POT6.1 POT7.1 POT8.1 POT9.1 POT10.1 POT11.1 POT12.1 U1.4(V-) U2.4(V-) U3.4(V-) U4.4(V-) U5.4(V-) U6.4(V-)
NetC1_2: R24.1 U4.5(IN+) ; port T4
NetC2_2: R36.1 U6.5(IN+) ; port T5
NetC3_2: R34.1 U6.3(IN+) ; port T6
NetC4_2: R12.1 U2.3(IN+) ; port T1
NetC5_2: R11.1 U2.5(IN+) ; port T2
NetC6_2: R23.1 U4.3(IN+) ; port T3
NetC7_2: R6.1 U1.3(IN+) ; port T7
NetC8_2: R17.1 U3.3(IN+) ; port T8
NetC9_2: R30.1 U5.5(IN+) ; port T9
NetC10_2: R5.1 U1.5(IN+) ; port T10
NetC11_2: R18.1 U3.5(IN+) ; port T11
NetC12_2: R28.1 U5.3(IN+) ; port T12
NetLED1_1: LED1.1(A) R1.1
NetLED1_2: LED1.2(K) R2.1 U1.7(OUT) ; port D10
NetLED2_1: LED2.1(A) R3.1
NetLED2_2: LED2.2(K) R4.1 U1.1(OUT) ; port D7
NetLED3_1: LED3.1(A) R7.1
NetLED3_2: LED3.2(K) R8.1 U2.7(OUT) ; port D2
NetLED4_1: LED4.1(A) R9.1
NetLED4_2: LED4.2(K) R10.1 U2.1(OUT) ; port D1
NetLED5_1: LED5.1(A) R16.1
NetLED5_2: LED5.2(K) R13.1 U3.1(OUT) ; port D8
NetLED6_1: LED6.1(A) R14.1
NetLED6_2: LED6.2(K) R15.1 U3.7(OUT) ; port D11
NetLED7_1: LED7.1(A) R22.1
NetLED7_2: LED7.2(K) R19.1 U4.1(OUT) ; port D3
NetLED8_1: LED8.1(A) R20.1
NetLED8_2: LED8.2(K) R21.1 U4.7(OUT) ; port D4
NetLED9_1: LED9.1(A) R25.1
NetLED9_2: LED9.2(K) R29.1 U5.1(OUT) ; port D12
NetLED10_1: LED10.1(A) R26.1
NetLED10_2: LED10.2(K) R27.1 U5.7(OUT) ; port D9
NetLED11_1: LED11.1(A) R31.1
NetLED11_2: LED11.2(K) R35.1 U6.1(OUT) ; port D6
NetLED12_1: LED12.1(A) R32.1
NetLED12_2: LED12.2(K) R33.1 U6.7(OUT) ; port D5
NetPOT1_2: POT1.2 U1.6(IN-)
NetPOT2_2: POT2.2 U1.2(IN-)
NetPOT3_2: POT3.2 U2.6(IN-)
NetPOT4_2: POT4.2 U2.2(IN-)
NetPOT5_2: POT5.2 U3.2(IN-)
NetPOT6_2: POT6.2 U3.6(IN-)
NetPOT7_2: POT7.2 U4.2(IN-)
NetPOT8_2: POT8.2 U4.6(IN-)
NetPOT9_2: POT9.2 U5.2(IN-)
NetPOT10_2: POT10.2 U5.6(IN-)
NetPOT11_2: POT11.2 U6.2(IN-)
NetPOT12_2: POT12.2 U6.6(IN-)

### Notes on the sheet
- Ball Gripper Circuits
- Potentiometric Circuits based on LM393D Amps, for MCU input from fototransistors
- Project
- Rev.
- Title
- Drawn by
- Date
- Sheet
- of
- Checked by

### Library data of the parts
LED1-LED12 = LED: Light-emitting diode; COLOR: RED
R1-R36 = RES: Resistior; Package: 0603
  R1 R3 R7 R9 R14 R16 R20 R22 R25 R26 R31 R32: Value: 500R
  R2 R4 R8 R10 R13 R15 R19 R21 R27 R29 R33 R35: Value: 300k
  R5 R6 R11 R12 R17 R18 R23 R24 R28 R30 R34 R36: Value: 10k
U1-U6 = LM393D: Low-Power Dual Voltage Comparator; Published: 24-Aug-2001; LatestRevisionDate: 13-Apr-2006; LatestRevisionNote: IPC-7351 Footprint Added.; DatasheetVersion: Jun-1998; PackageVersion: Dec-2002; PackageReference: SO8; Publisher: Altium Limited; PackageDescription: 8-Pin Small Outline Integrated Circuit 1.27 mm Pitch; Code_JEDEC: MS-012-AA; Code_IPC: SOIC127P600-8; ComponentLink1Description: Manufacturer Link; ComponentLink1URL: http://www.st.com/; ComponentLink2Description: Datasheet; ComponentLink2URL: http://www.st.com/stonline/products/literature/ds/2164/lm293.pdf

## Sheet GTM_LeftJawGrippersMotorsConnectors.SchDoc
size A4
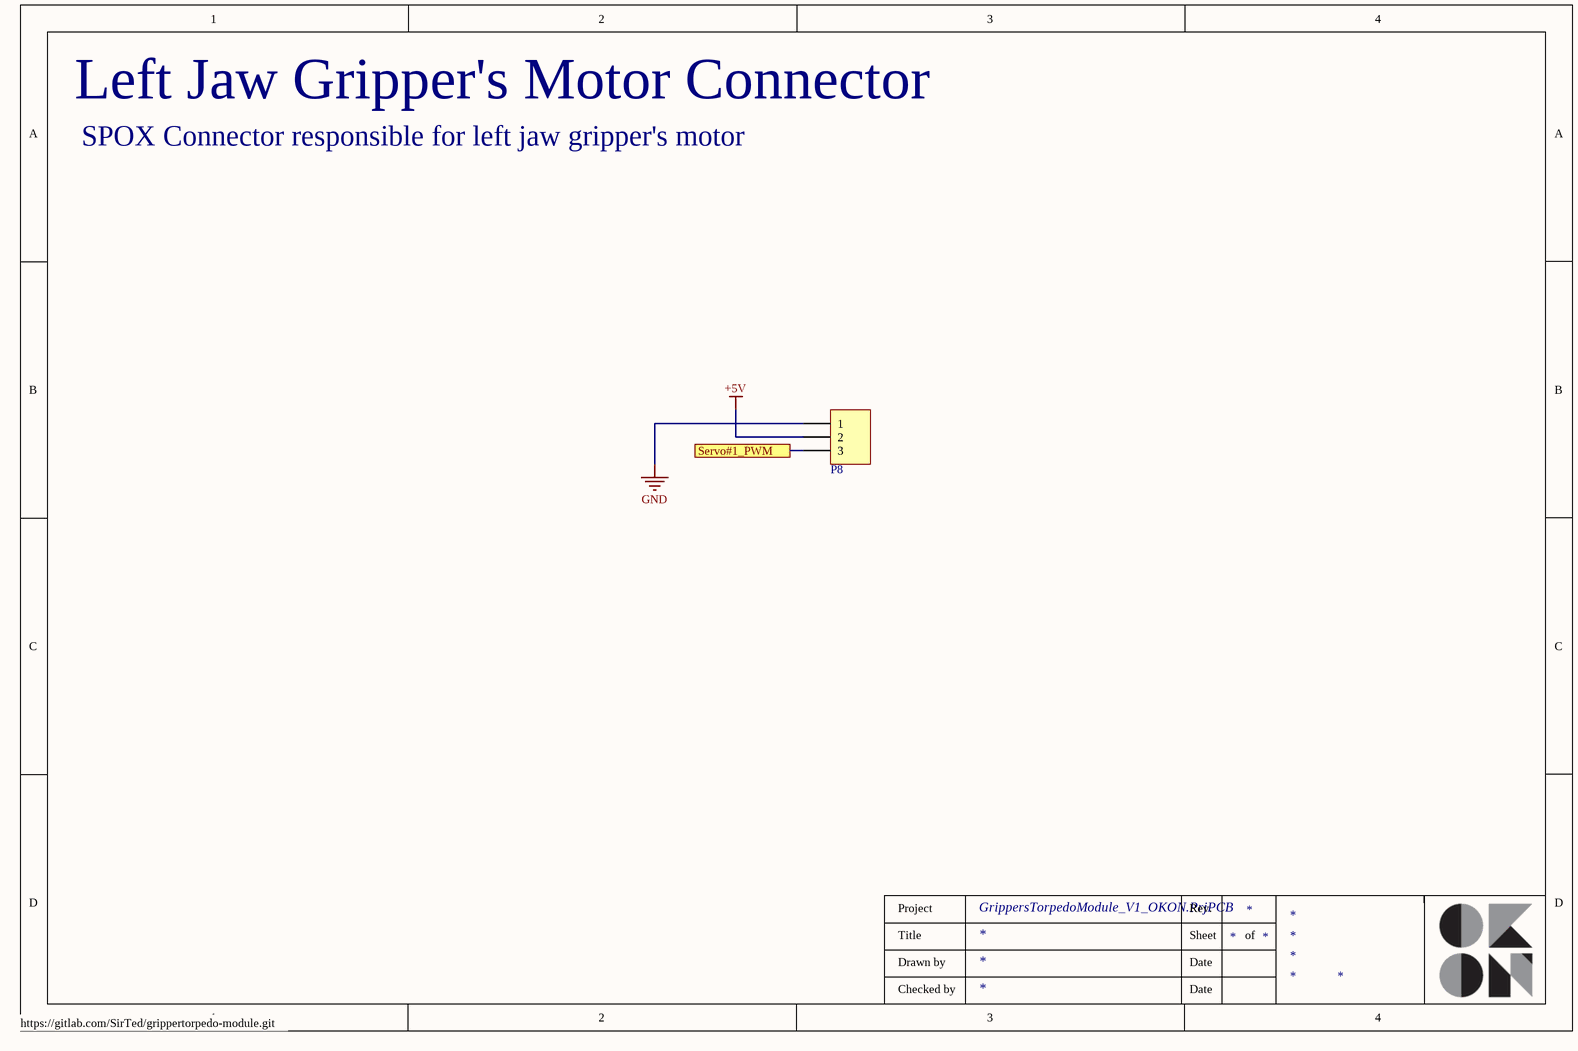
[diagram p6: GTM_LeftJawGrippersMotorsConnectors.SchDoc]

### Parts
P8  HDR1X3  [Molex SPOX Horizontal 3 Circuits]  (value not drawn)

### Ports
Servo#1_PWM

### Nets
+5V: P8.2
GND: P8.1
Servo#1_PWM: P8.3 ; port Servo#1_PWM

### Notes on the sheet
- Left Jaw Gripper's Motor Connector
- SPOX Connector responsible for left jaw gripper's motor
- https://gitlab.com/SirTed/grippertorpedo-module.git
- Project
- Rev.
- Title
- Drawn by
- Date
- Sheet
- of
- Checked by

### Library data of the parts
P8 = HDR1X3: Header, 3-Pin; LatestRevisionDate: 17-Jul-2002; LatestRevisionNote: Re-released for DXP Platform.; Publisher: Altium Limited

## Sheet GTM_RightJawGrippersMotorConnector.SchDoc
size A4
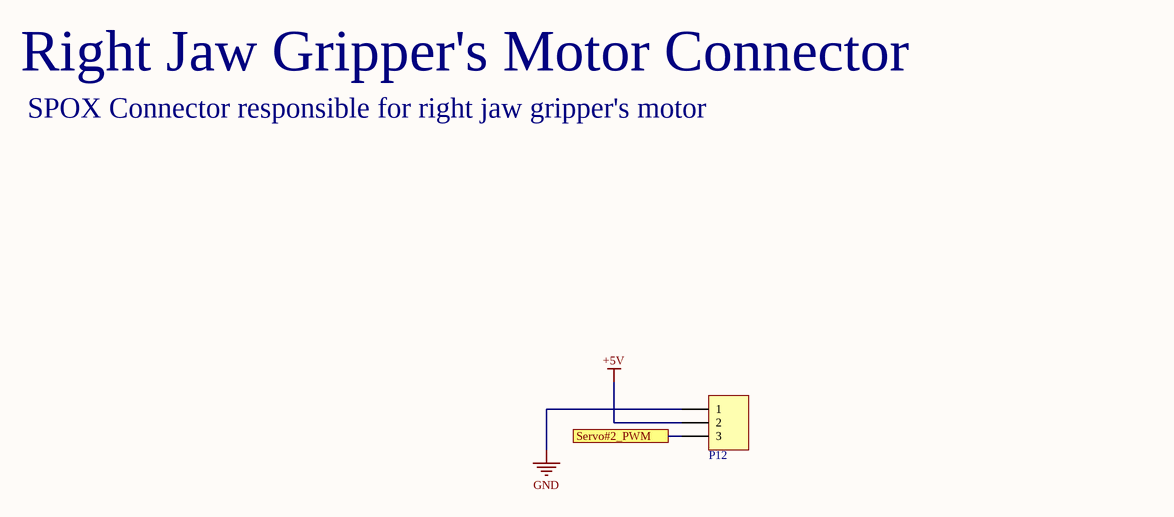
[diagram p7: GTM_RightJawGrippersMotorConnector.SchDoc]

### Parts
P12  HDR1X3  [Molex SPOX Horizontal 3 Circuits]  (value not drawn)

### Ports
Servo#2_PWM

### Nets
+5V: P12.2
GND: P12.1
Servo#2_PWM: P12.3 ; port Servo#2_PWM

### Notes on the sheet
- Right Jaw Gripper's Motor Connector
- SPOX Connector responsible for right jaw gripper's motor
- Project
- Rev.
- Title
- Drawn by
- Date
- Sheet
- of
- Checked by

### Library data of the parts
P12 = HDR1X3: Header, 3-Pin; LatestRevisionDate: 17-Jul-2002; LatestRevisionNote: Re-released for DXP Platform.; Publisher: Altium Limited

## Sheet GTM_TorpedoModuleControlConnector.SchDoc
size A4
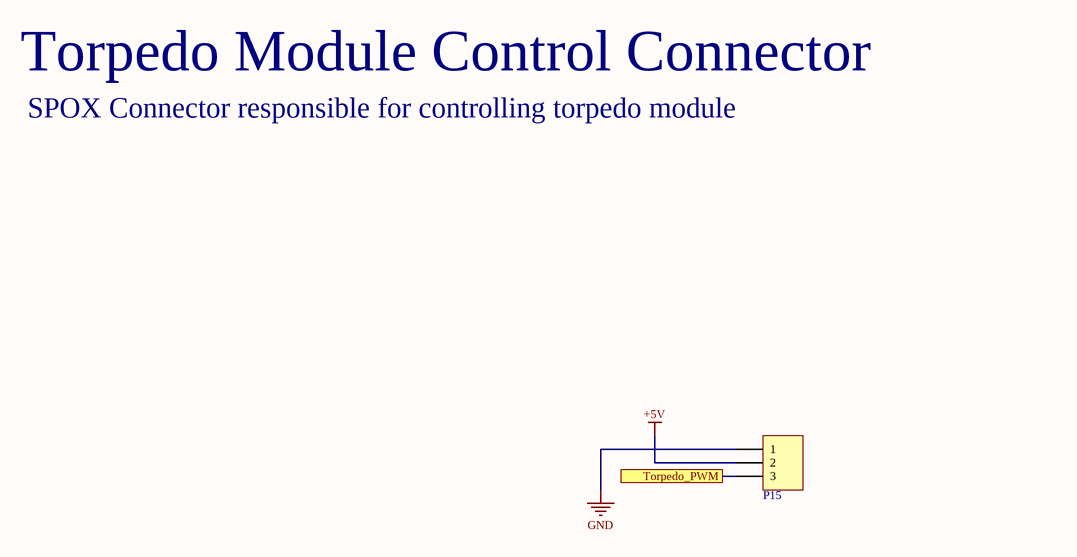
[diagram p8: GTM_TorpedoModuleControlConnector.SchDoc]

### Parts
P15  HDR1X3  [Molex SPOX Horizontal 3 Circuits]  (value not drawn)

### Ports
Torpedo_PWM

### Nets
+5V: P15.2
GND: P15.1
Torpedo_PWM: P15.3 ; port Torpedo_PWM

### Notes on the sheet
- Torpedo Module Control Connector
- SPOX Connector responsible for controlling torpedo module
- Project
- Rev.
- Title
- Drawn by
- Date
- Sheet
- of
- Checked by

### Library data of the parts
P15 = HDR1X3: Header, 3-Pin; LatestRevisionDate: 17-Jul-2002; LatestRevisionNote: Re-released for DXP Platform.; Publisher: Altium Limited

## Sheet GTM_PowerCircuits.SchDoc
size A4
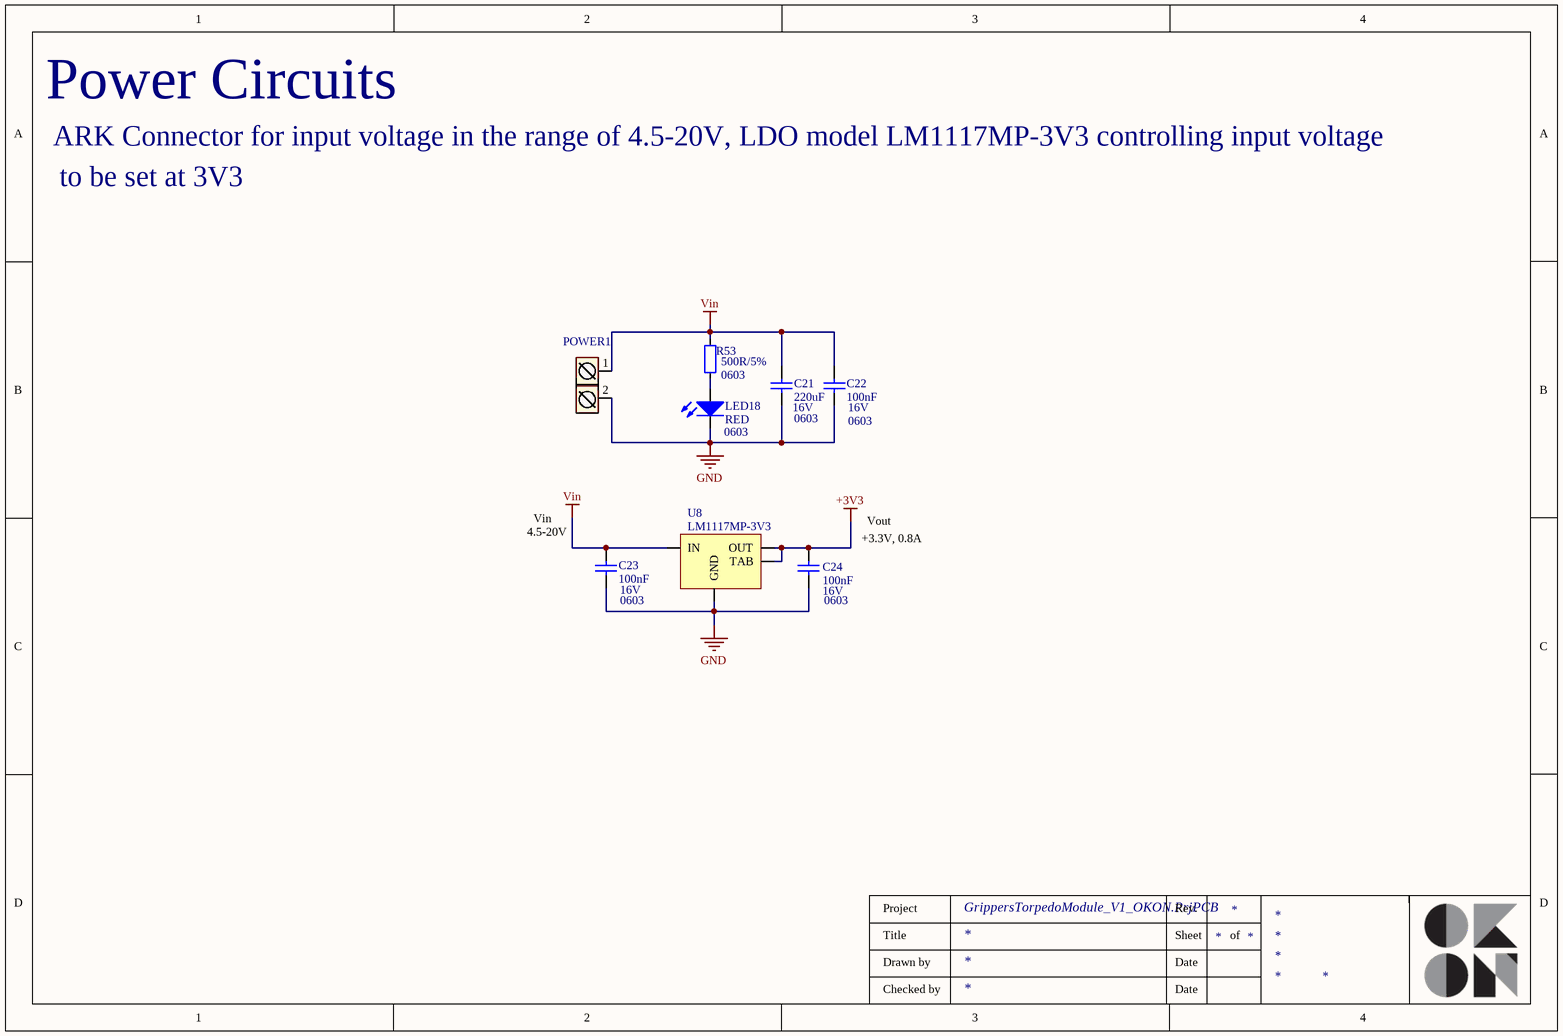
[diagram p9: GTM_PowerCircuits.SchDoc]

### Parts
C21  value 220uF  Package: 0603  Capacity: 16V  [0603_CAP]  (hidden comment: Cap)
C22  value 100nF  Package: 0603  Capacity: 16V  [0603_CAP]  (hidden comment: Cap)
C23  value 100nF  Package: 0603  Capacity: 16V  [0603_CAP]  (hidden comment: Cap)
C24  value 100nF  Package: 0603  Capacity: 16V  [0603_CAP]  (hidden comment: Cap)
LED18  RED  Package: 0603  [0603_led_red]
POWER1  ARK2  [ARK2]  (value not drawn)
R53  500R/5%  [0603]
U8  LM1117MP-3V3  [SOT223]

### Nets
+3V3: C24.1 U8.2(OUT) U8.4(TAB)
GND: C21.1 C22.1 C23.2 C24.2 LED18.2(K) POWER1.2 U8.1(GND)
Vin: C21.2 C22.2 C23.1 POWER1.1 R53.2 U8.3(IN)
NetLED18_1: LED18.1(A) R53.1

### Notes on the sheet
- Power Circuits
- ARK Connector for input voltage in the range of 4.5-20V, LDO model LM1117MP-3V3 controlling input voltage
- to be set at 3V3
- (near C23) 4.5-20V
- Vin
- +3.3V, 0.8A
- Vout
- Project
- Rev.
- Title
- Drawn by
- Date
- Sheet
- of
- Checked by

### Library data of the parts
C21-C24 = Cap: Ceramic capacitor; Unit Price1: *; Unit Price2: *
LED18 = LED: Light-emitting diode; COLOR: RED
POWER1 = ARK2: Złącze śrubowe 2 piny
R53 = RES: Resistior; Value: 500R/5%; Package: 0603
U8 = LM1117MP-3V3: 800mA Low-Dropout Linear Regulator; PartNumber: LM1117MP-3.3; Manufacturer: National Semiconductor; CompType: LDO IC; PackageTopMarking: XYTT*N05A; PowerWise: N; DatasheetVersion: Apr-2006; PackageVersion: revB, Apr-2003; PackageReference: MP04A; PackageDescription: Molded SOT-223, 6.50 x 3.56 x 1.6mm Body, 4 Lead, 2.3mm Pitch; ComponentLink1Description: LM1117 Datasheet; ComponentLink1URL: http://www.national.com/ds/LM/LM1117.pdf; ComponentLink2Description: LM1117 Web Page; ComponentLink2URL: http://www.national.com/pf/LM/LM1117.html; Published: 4-Dec-2008; Publisher: Altium Limited; RoHS: O; PinCount: 4; DigiKeyPartNumber: LM1117MP-3.3CT-ND; Code_JEDEC: TO-261-AA; Code_IPC: SOT223-4; ComponentLink3Description: MP04A Package Page; ComponentLink3URL: http://www.national.com/packaging/folders/mp04a.html

## Sheet GTM_BallGrippersFototransistorsConnectors.SchDoc
size A4
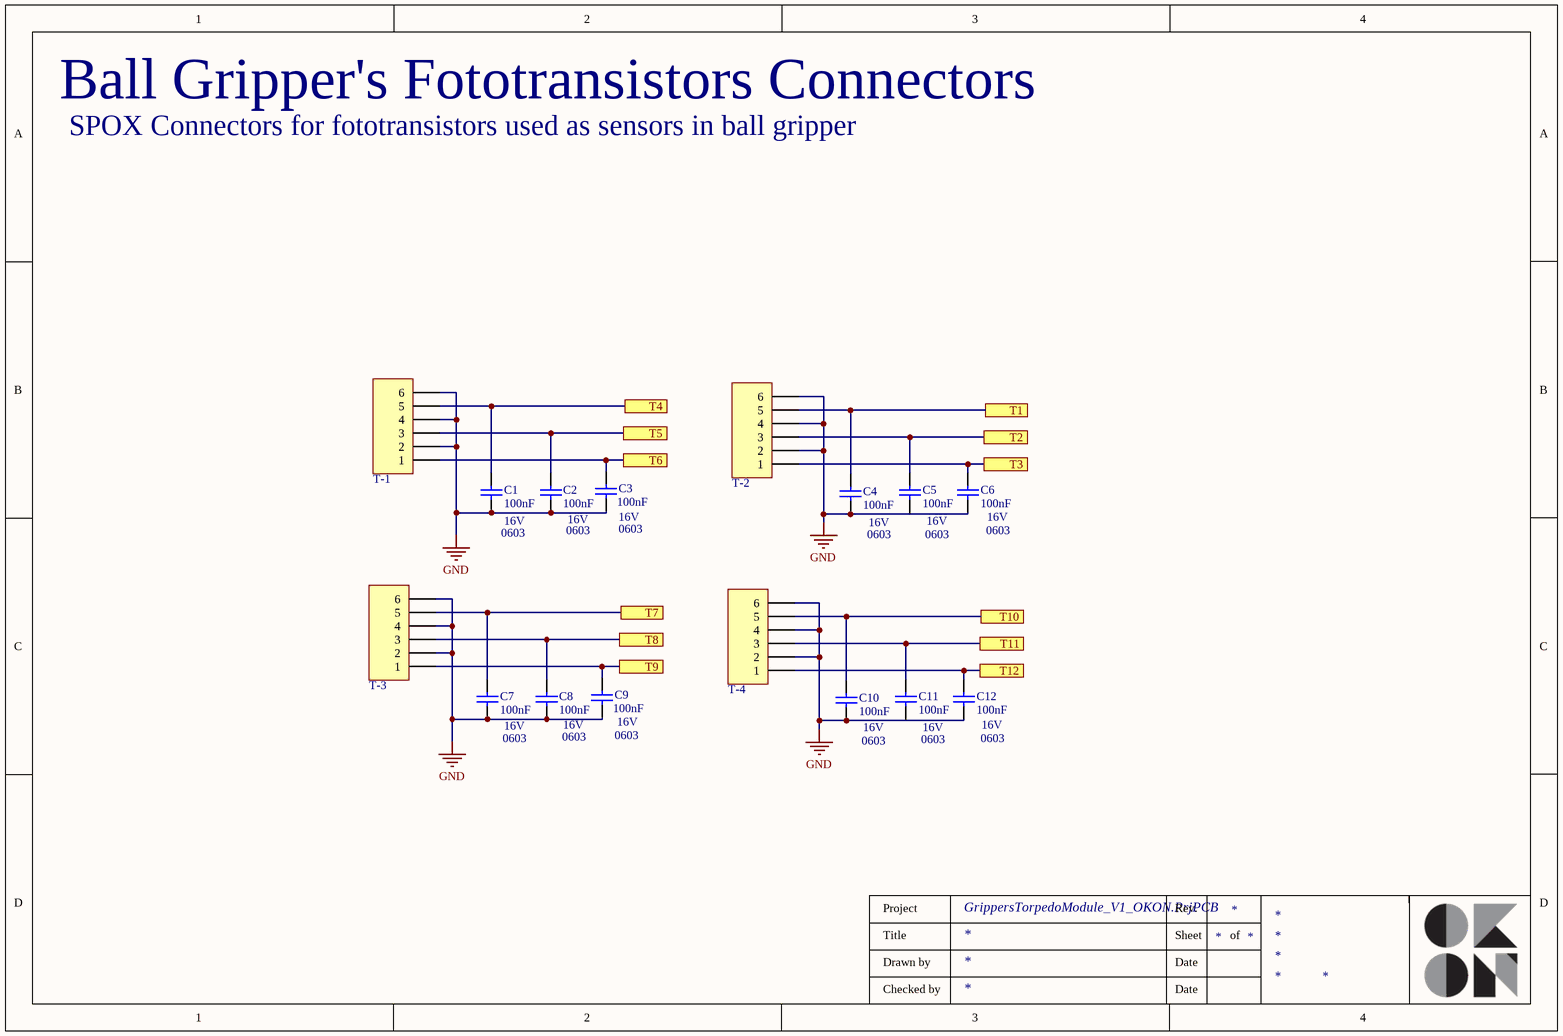
[diagram p10: GTM_BallGrippersFototransistorsConnectors.SchDoc]

### Parts
C1  value 100nF  Package: 0603  Capacity: 16V  [0603_CAP]  (hidden comment: Cap)
C2  value 100nF  Package: 0603  Capacity: 16V  [0603_CAP]  (hidden comment: Cap)
C3  value 100nF  Package: 0603  Capacity: 16V  [0603_CAP]  (hidden comment: Cap)
C4  value 100nF  Package: 0603  Capacity: 16V  [0603_CAP]  (hidden comment: Cap)
C5  value 100nF  Package: 0603  Capacity: 16V  [0603_CAP]  (hidden comment: Cap)
C6  value 100nF  Package: 0603  Capacity: 16V  [0603_CAP]  (hidden comment: Cap)
C7  value 100nF  Package: 0603  Capacity: 16V  [0603_CAP]  (hidden comment: Cap)
C8  value 100nF  Package: 0603  Capacity: 16V  [0603_CAP]  (hidden comment: Cap)
C9  value 100nF  Package: 0603  Capacity: 16V  [0603_CAP]  (hidden comment: Cap)
C10  value 100nF  Package: 0603  Capacity: 16V  [0603_CAP]  (hidden comment: Cap)
C11  value 100nF  Package: 0603  Capacity: 16V  [0603_CAP]  (hidden comment: Cap)
C12  value 100nF  Package: 0603  Capacity: 16V  [0603_CAP]  (hidden comment: Cap)
T-1  HDR1X6  [Molex SPOX Horizontal 6 Circuits]  (value not drawn)
T-2  HDR1X6  [Molex SPOX Horizontal 6 Circuits]  (value not drawn)
T-3  HDR1X6  [Molex SPOX Horizontal 6 Circuits]  (value not drawn)
T-4  HDR1X6  [Molex SPOX Horizontal 6 Circuits]  (value not drawn)

### Ports
T1, T2, T3, T4, T5, T6, T7, T8, T9, T10, T11, T12

### Nets
GND: C1.1 C2.1 C3.1 C4.1 C6.1 C7.1 C8.1 C9.1 C10.1 C12.1 T-1.2 T-1.4 T-1.6 T-2.2 T-2.4 T-2.6 T-3.2 T-3.4 T-3.6 T-4.2 T-4.4 T-4.6
NetC1_2: C1.2 T-1.5 ; port T4
NetC2_2: C2.2 T-1.3 ; port T5
NetC3_2: C3.2 T-1.1 ; port T6
NetC4_2: C4.2 T-2.5 ; port T1
NetC5_2: C5.2 T-2.3 ; port T2
NetC6_2: C6.2 T-2.1 ; port T3
NetC7_2: C7.2 T-3.5 ; port T7
NetC8_2: C8.2 T-3.3 ; port T8
NetC9_2: C9.2 T-3.1 ; port T9
NetC10_2: C10.2 T-4.5 ; port T10
NetC11_2: C11.2 T-4.3 ; port T11
NetC12_2: C12.2 T-4.1 ; port T12

Not connected (* = marked no-connect by the designer): C5 1; C11 1

### Notes on the sheet
- Ball Gripper's Fototransistors Connectors
- SPOX Connectors for fototransistors used as sensors in ball gripper
- Project
- Rev.
- Title
- Drawn by
- Date
- Sheet
- of
- Checked by

### Library data of the parts
C1-C12 = Cap: Ceramic capacitor
T-1-T-4 = HDR1X6: Header, 6-Pin; LatestRevisionDate: 17-Jul-2002; LatestRevisionNote: Re-released for DXP Platform.; Publisher: Altium Limited

## Sheet GTM_BallGrippersDiodesConnectors.SchDoc: Ball Gripper's Diodes Connectors
size A4; DrawnBy: Tadeusz Golczyk
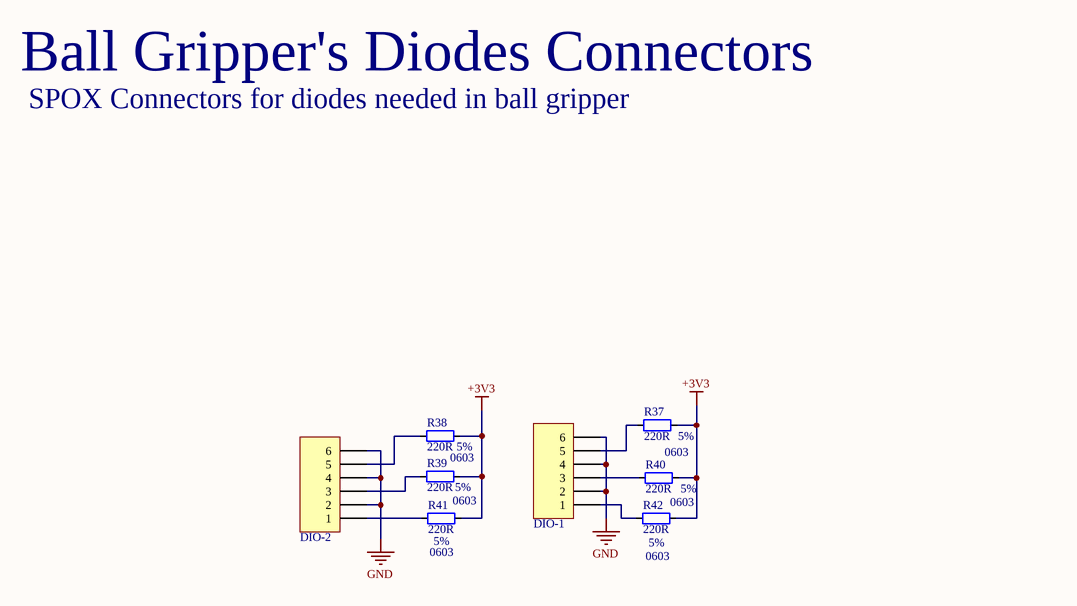
[diagram p11: GTM_BallGrippersDiodesConnectors.SchDoc]

### Parts
DIO-1  HDR1X6  [Molex SPOX Horizontal 6 Circuits]  (value not drawn)
DIO-2  HDR1X6  [Molex SPOX Horizontal 6 Circuits]  (value not drawn)
R37  Tolerance: 5%  [0603]  (hidden comment: 220R)
R38  Tolerance: 5%  [0603]  (hidden comment: 220R)
R39  Tolerance: 5%  [0603]  (hidden comment: 220R)
R40  Tolerance: 5%  [0603]  (hidden comment: 220R)
R41  Tolerance: 5%  [0603]  (hidden comment: 220R)
R42  Tolerance: 5%  [0603]  (hidden comment: 220R)

### Nets
+3V3: R37.1 R38.1 R39.1 R40.1 R41.1 R42.1
GND: DIO-1.2 DIO-1.4 DIO-1.6 DIO-2.2 DIO-2.4 DIO-2.6
NetDIO-1_1: DIO-1.1 R42.2
NetDIO-1_3: DIO-1.3 R40.2
NetDIO-1_5: DIO-1.5 R37.2
NetDIO-2_1: DIO-2.1 R41.2
NetDIO-2_3: DIO-2.3 R39.2
NetDIO-2_5: DIO-2.5 R38.2

### Notes on the sheet
- Ball Gripper's Diodes Connectors
- SPOX Connectors for diodes needed in ball gripper
- Project
- Rev.
- Title
- Drawn by
- Date
- Sheet
- of
- Checked by

### Library data of the parts
DIO-1 DIO-2 = HDR1X6: Header, 6-Pin; LatestRevisionDate: 17-Jul-2002; LatestRevisionNote: Re-released for DXP Platform.; Publisher: Altium Limited
R37-R42 = RES: Resistior; Value: 220R; Package: 0603

## Sheet GTM_BallGrippersMotorConnector.SchDoc
size A4
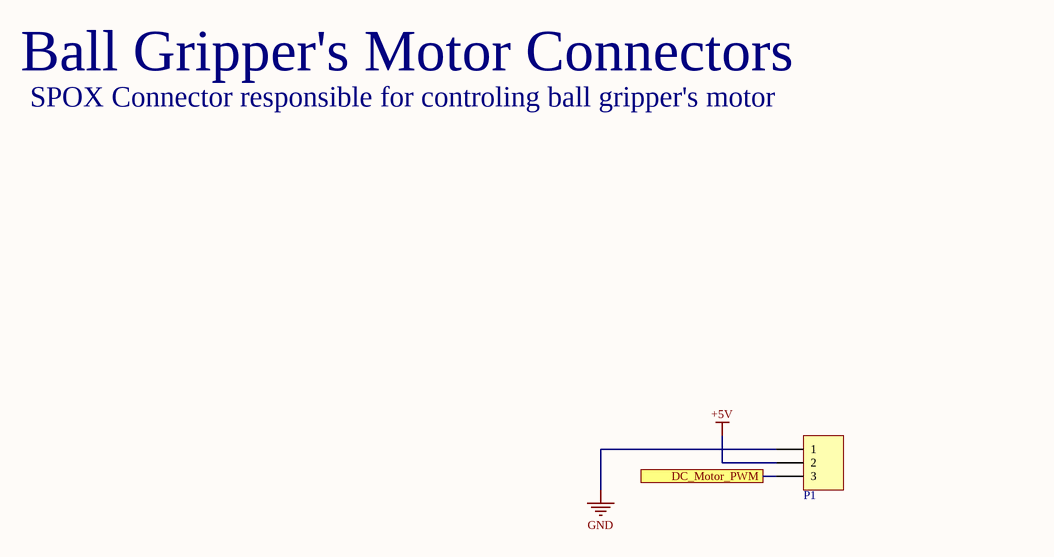
[diagram p12: GTM_BallGrippersMotorConnector.SchDoc]

### Parts
P1  HDR1X3  [Molex SPOX Horizontal 3 Circuits]  (value not drawn)

### Ports
DC_Motor_PWM

### Nets
+5V: P1.2
GND: P1.1
DC_Motor_PWM: P1.3 ; port DC_Motor_PWM

### Notes on the sheet
- Ball Gripper's Motor Connectors
- SPOX Connector responsible for controling ball gripper's motor
- Project
- Rev.
- Title
- Drawn by
- Date
- Sheet
- of
- Checked by

### Library data of the parts
P1 = HDR1X3: Header, 3-Pin; LatestRevisionDate: 17-Jul-2002; LatestRevisionNote: Re-released for DXP Platform.; Publisher: Altium Limited

## Sheet GTM_UARTconnector.SchDoc
size A4
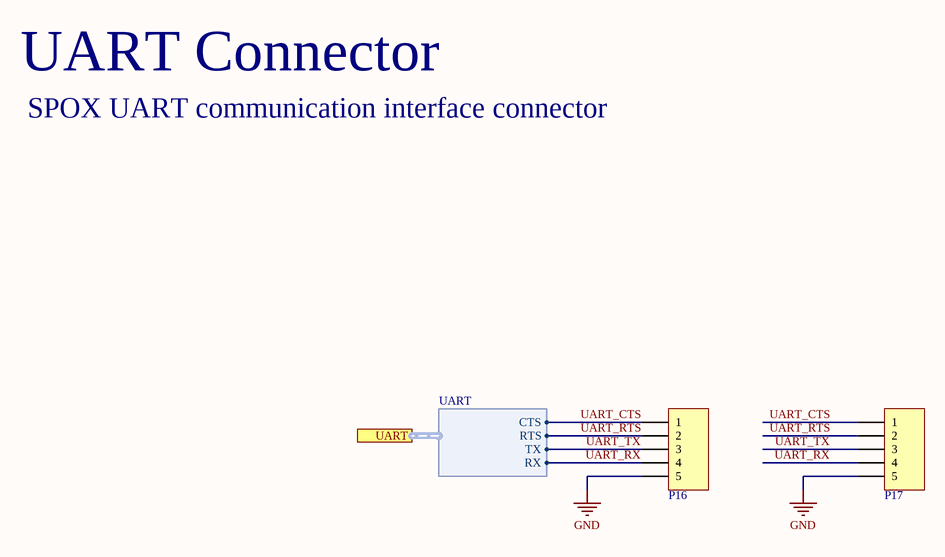
[diagram p13: GTM_UARTconnector.SchDoc]

### Parts
P16  HDR1X5  [Molex SPOX Horizontal 5 Circuits]  (value not drawn)
P17  HDR1X5  [Molex SPOX Horizontal 5 Circuits]  (value not drawn)

### Ports
UART (harness UART)

### Harnesses
UART: CTS, RTS, TX, RX

### Nets
GND: P16.5 P17.5
UART_CTS: P16.1 P17.1 ; port UART.CTS
UART_RTS: P16.2 P17.2 ; port UART.RTS
UART_RX: P16.4 P17.4 ; port UART.RX
UART_TX: P16.3 P17.3 ; port UART.TX

### Notes on the sheet
- UART Connector
- SPOX UART communication interface connector
- Project
- Rev.
- Title
- Drawn by
- Date
- Sheet
- of
- Checked by

### Library data of the parts
P16 = HDR1X5: Header, 5-Pin; LatestRevisionDate: 17-Jul-2002; LatestRevisionNote: Re-released for DXP Platform.; Publisher: Altium Limited
P17 = HDR1X5: Doubled Connector; LatestRevisionDate: 17-Jul-2002; LatestRevisionNote: Re-released for DXP Platform.; Publisher: Altium Limited

## Sheet GTM_CANconnector.SchDoc
size A4
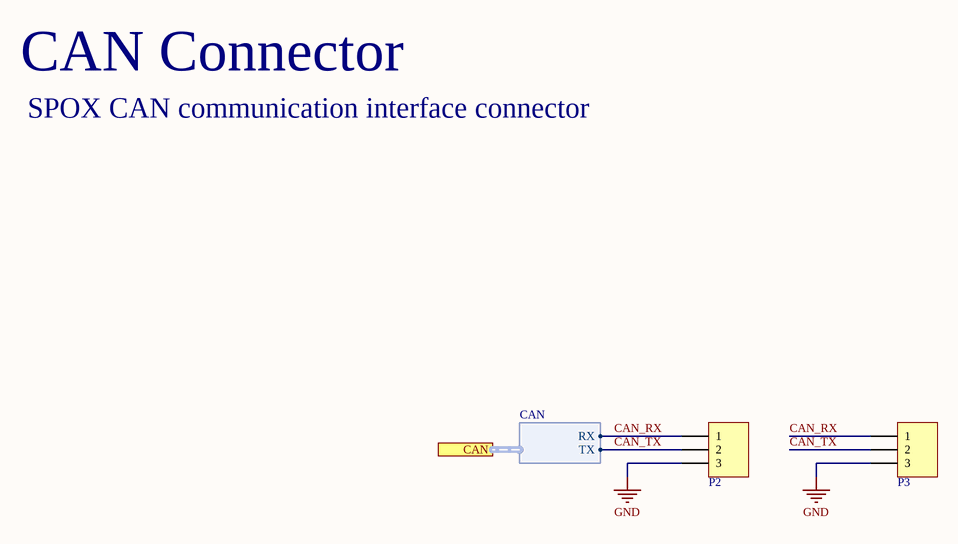
[diagram p14: GTM_CANconnector.SchDoc]

### Parts
P2  HDR1X3  [HDR1X3]  (value not drawn)
P3  Doubled Connector  [HDR1X3]  (value not drawn)

### Ports
CAN (harness CAN)

### Harnesses
CAN: RX, TX

### Nets
GND: P2.3 P3.3
CAN_RX: P2.1 P3.1 ; port CAN.RX
CAN_TX: P2.2 P3.2 ; port CAN.TX

### Notes on the sheet
- CAN Connector
- SPOX CAN communication interface connector
- Project
- Rev.
- Title
- Drawn by
- Date
- Sheet
- of
- Checked by

### Library data of the parts
P2 P3 = HDR1X3: Header, 3-Pin; LatestRevisionDate: 17-Jul-2002; LatestRevisionNote: Re-released for DXP Platform.; Publisher: Altium Limited

## Sheet GTM_I2Cconnector.SchDoc
size A4
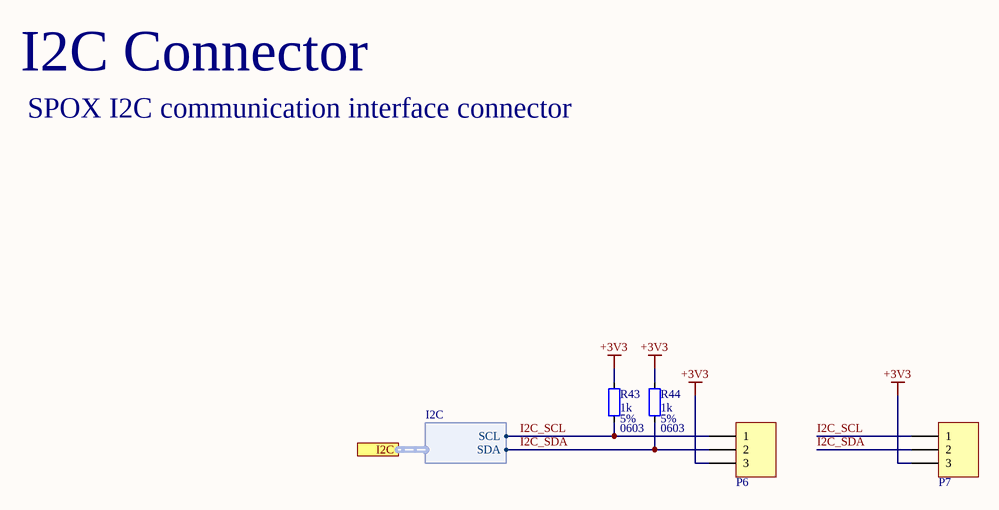
[diagram p15: GTM_I2Cconnector.SchDoc]

### Parts
P6  HDR1X3  [Molex SPOX Horizontal 3 Circuits]  (value not drawn)
P7  HDR1X3  [Molex SPOX Horizontal 3 Circuits]  (value not drawn)
R43  Tolerance: 5%  [0603]  (hidden comment: 1k)
R44  Tolerance: 5%  [0603]  (hidden comment: 1k)

### Ports
I2C (harness I2C)

### Harnesses
I2C: SCL, SDA

### Nets
+3V3: P6.3 P7.3 R43.2 R44.2
I2C_SCL: P6.1 P7.1 R43.1 ; port I2C.SCL
I2C_SDA: P6.2 P7.2 R44.1 ; port I2C.SDA

### Notes on the sheet
- I2C Connector
- SPOX I2C communication interface connector
- Project
- Rev.
- Title
- Drawn by
- Date
- Sheet
- of
- Checked by

### Library data of the parts
P6 = HDR1X3: Header, 3-Pin; LatestRevisionDate: 17-Jul-2002; LatestRevisionNote: Re-released for DXP Platform.; Publisher: Altium Limited
P7 = HDR1X3: Doubled Ceonnector; LatestRevisionDate: 17-Jul-2002; LatestRevisionNote: Re-released for DXP Platform.; Publisher: Altium Limited
R43 R44 = RES: Resistior; Value: 1k; Package: 0603

## Sheet GTM_SPIconnector.SchDoc
size A4
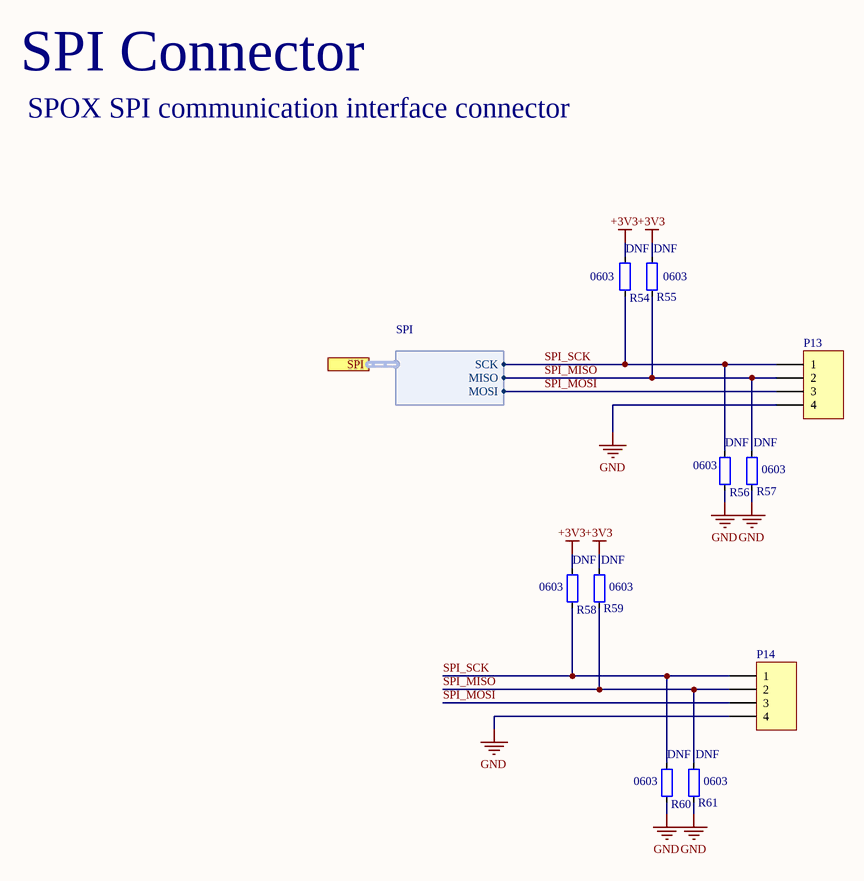
[diagram p16: GTM_SPIconnector.SchDoc]

### Parts
P13  HDR1X4  [Molex SPOX Angle 4 Circuits]  (value not drawn)
P14  HDR1X4  [Molex SPOX Angle 4 Circuits]  (value not drawn)
R54  DNF  [0603]
R55  DNF  [0603]
R56  DNF  [0603]
R57  DNF  [0603]
R58  DNF  [0603]
R59  DNF  [0603]
R60  DNF  [0603]
R61  DNF  [0603]

### Ports
SPI (harness SPI)

### Harnesses
SPI: SCK, MISO, MOSI

### Nets
+3V3: R54.2 R55.2 R58.2 R59.2
GND: P13.4 P14.4 R56.1 R57.1 R60.1 R61.1
SPI_MISO: P13.2 P14.2 R55.1 R57.2 R59.1 R61.2 ; port SPI.MISO
SPI_MOSI: P13.3 P14.3 ; port SPI.MOSI
SPI_SCK: P13.1 P14.1 R54.1 R56.2 R58.1 R60.2 ; port SPI.SCK

### Notes on the sheet
- SPI Connector
- SPOX SPI communication interface connector
- Project
- Rev.
- Title
- Drawn by
- Date
- Sheet
- of
- Checked by

### Library data of the parts
P13 = HDR1X4: Header, 4-Pin; LatestRevisionDate: 17-Jul-2002; LatestRevisionNote: Re-released for DXP Platform.; Publisher: Altium Limited
P14 = HDR1X4: Doubled SPI Connector; LatestRevisionDate: 17-Jul-2002; LatestRevisionNote: Re-released for DXP Platform.; Publisher: Altium Limited
R54-R61 = RES: Resistior; Value: DNF; Tolerance: *; Package: 0603

## Sheet GTM_FreePinsHeaders.SchDoc
size A4
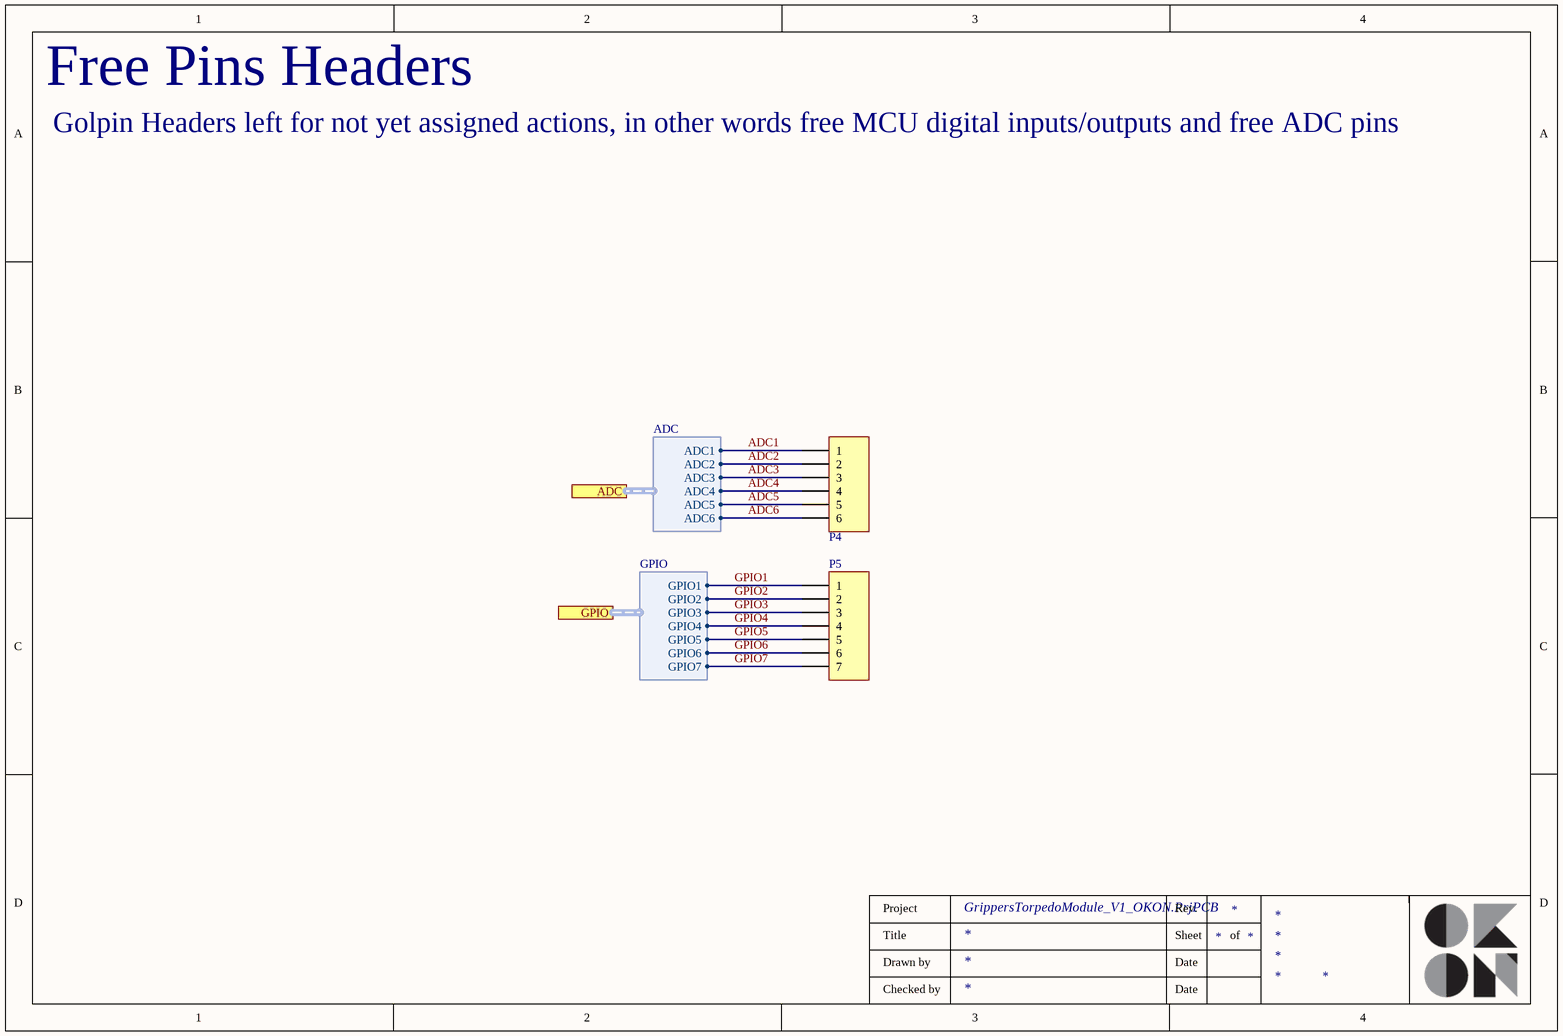
[diagram p17: GTM_FreePinsHeaders.SchDoc]

### Parts
P4  HDR1X6  [HDR1X6]  (value not drawn)
P5  HDR1X7  [HDR1X7]  (value not drawn)

### Ports
ADC (harness ADC), GPIO (harness GPIO)

### Harnesses
ADC: ADC1, ADC2, ADC3, ADC4, ADC5, ADC6
GPIO: GPIO1, GPIO2, GPIO3, GPIO4, GPIO5, GPIO6, GPIO7

### Nets
ADC1: P4.1 ; port ADC.ADC1
ADC2: P4.2 ; port ADC.ADC2
ADC3: P4.3 ; port ADC.ADC3
ADC4: P4.4 ; port ADC.ADC4
ADC5: P4.5 ; port ADC.ADC5
ADC6: P4.6 ; port ADC.ADC6
GPIO1: P5.1 ; port GPIO.GPIO1
GPIO2: P5.2 ; port GPIO.GPIO2
GPIO3: P5.3 ; port GPIO.GPIO3
GPIO4: P5.4 ; port GPIO.GPIO4
GPIO5: P5.5 ; port GPIO.GPIO5
GPIO6: P5.6 ; port GPIO.GPIO6
GPIO7: P5.7 ; port GPIO.GPIO7

### Notes on the sheet
- Free Pins Headers
- Golpin Headers left for not yet assigned actions, in other words free MCU digital inputs/outputs and free ADC pins
- Project
- Rev.
- Title
- Drawn by
- Date
- Sheet
- of
- Checked by

### Library data of the parts
P4 = HDR1X6: Header, 6-Pin; LatestRevisionDate: 17-Jul-2002; LatestRevisionNote: Re-released for DXP Platform.; Publisher: Altium Limited
P5 = HDR1X7: Header, 7-Pin; LatestRevisionDate: 17-Jul-2002; LatestRevisionNote: Re-released for DXP Platform.; Publisher: Altium Limited

## Sheet GTM_ProgrammingConnector.SchDoc
size A4
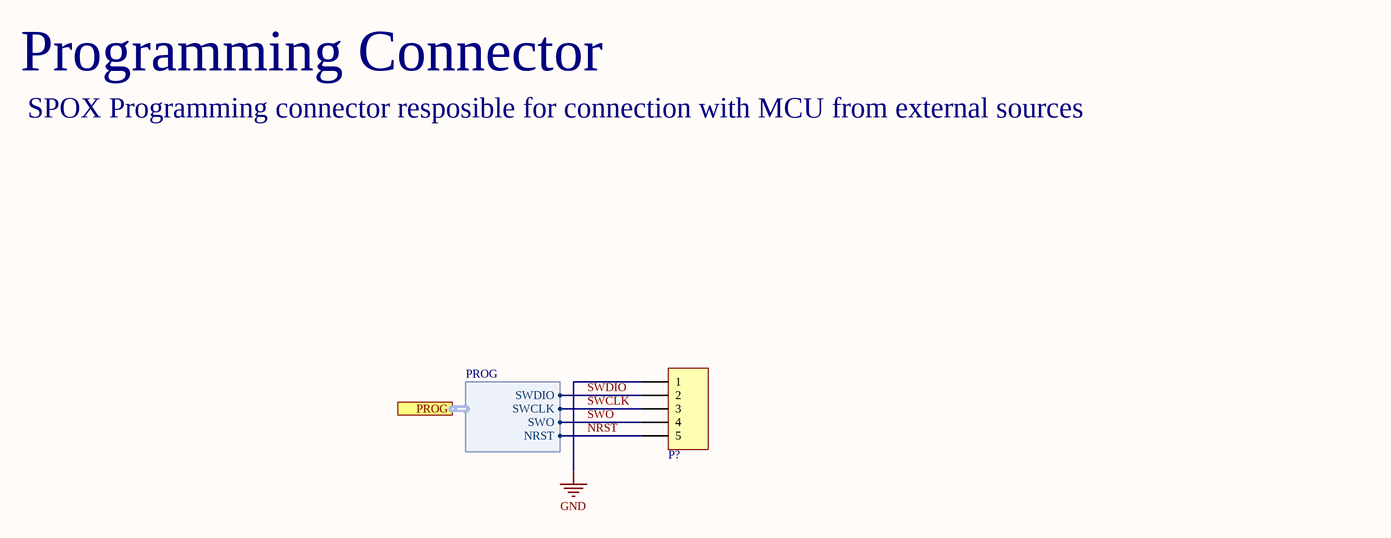
[diagram p18: GTM_ProgrammingConnector.SchDoc]

### Parts
P?  HDR1X5  [Molex SPOX Angle 5 Circuits]  (value not drawn)

### Ports
PROG (harness PROG)

### Harnesses
PROG: SWDIO, SWCLK, SWO, NRST

### Nets
GND: P?.1
NRST: P?.5 ; port PROG.NRST
SWCLK: P?.3 ; port PROG.SWCLK
SWDIO: P?.2 ; port PROG.SWDIO
SWO: P?.4 ; port PROG.SWO

### Notes on the sheet
- Programming Connector
- SPOX Programming connector resposible for connection with MCU from external sources
- Project
- Rev.
- Title
- Drawn by
- Date
- Sheet
- of
- Checked by

### Library data of the parts
P? = HDR1X5: Header, 5-Pin; LatestRevisionDate: 17-Jul-2002; LatestRevisionNote: Re-released for DXP Platform.; Publisher: Altium Limited

## Sheet GTM_PowerConnector.SchDoc
size A4
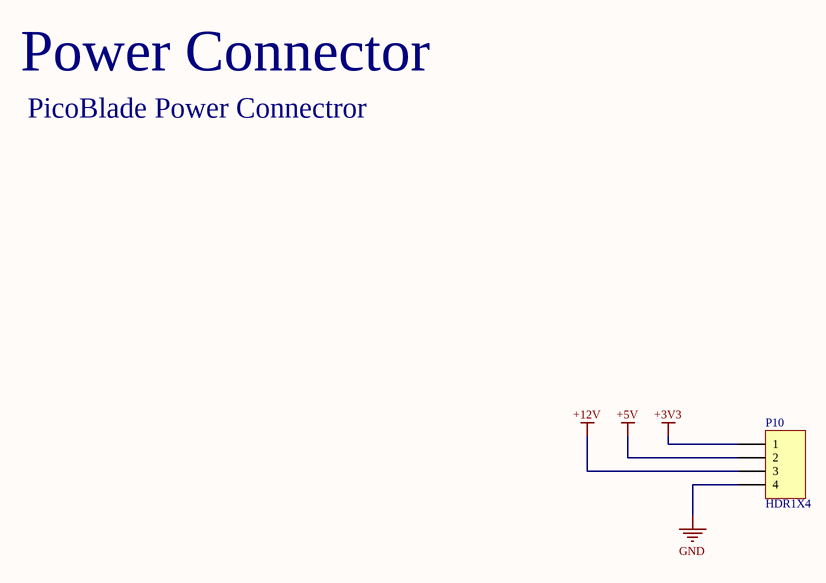
[diagram p19: GTM_PowerConnector.SchDoc]

### Parts
P10  HDR1X4  [PicoBlade SMD Angle 4 Circuits]

### Nets
+3V3: P10.1
+5V: P10.2
+12V: P10.3
GND: P10.4

### Notes on the sheet
- Power Connector
- PicoBlade Power Connectror
- Project
- Rev.
- Title
- Drawn by
- Date
- Sheet
- of
- Checked by

### Library data of the parts
P10 = HDR1X4: Header, 4-Pin; LatestRevisionDate: 17-Jul-2002; LatestRevisionNote: Re-released for DXP Platform.; Publisher: Altium Limited

## Nets that join several sheets
+3V3: GTM_MCU (12 pins), GTM_BallGrippersCircuits (54 pins), GTM_PowerCircuits (C24.1 U8.2 U8.4), GTM_BallGrippersDiodesConnectors (6 pins), GTM_I2Cconnector (P6.3 P7.3 R43.2 R44.2), GTM_SPIconnector (R54.2 R55.2 R58.2 R59.2), GTM_PowerConnector (P10.1)
+5V: GTM_LeftJawGrippersMotorsConnectors (P8.2), GTM_RightJawGrippersMotorConnector (P12.2), GTM_TorpedoModuleControlConnector (P15.2), GTM_BallGrippersMotorConnector (P1.2), GTM_PowerConnector (P10.2)
GND: GTM_MCU (15 pins), GTM_MCUcontrolledLEDs (5 pins), GTM_BallGrippersCircuits (18 pins), GTM_LeftJawGrippersMotorsConnectors (P8.1), GTM_RightJawGrippersMotorConnector (P12.1), GTM_TorpedoModuleControlConnector (P15.1), GTM_PowerCircuits (7 pins), GTM_BallGrippersFototransistorsConnectors (22 pins), GTM_BallGrippersDiodesConnectors (6 pins), GTM_BallGrippersMotorConnector (P1.1), GTM_UARTconnector (P16.5 P17.5), GTM_CANconnector (P2.3 P3.3), GTM_SPIconnector (6 pins), GTM_ProgrammingConnector (P?.1), GTM_PowerConnector (P10.4)
ADC1: GTM_MCU (U7.8), GTM_FreePinsHeaders (P4.1)
ADC2: GTM_MCU (U7.9), GTM_FreePinsHeaders (P4.2)
ADC3: GTM_MCU (U7.10), GTM_FreePinsHeaders (P4.3)
ADC4: GTM_MCU (U7.11), GTM_FreePinsHeaders (P4.4)
ADC5: GTM_MCU (U7.24), GTM_FreePinsHeaders (P4.5)
ADC6: GTM_MCU (U7.25), GTM_FreePinsHeaders (P4.6)
CAN_RX: GTM_MCU (U7.44), GTM_CANconnector (P2.1 P3.1)
CAN_TX: GTM_MCU (U7.45), GTM_CANconnector (P2.2 P3.2)
DC_Motor_PWM: GTM_MCU (U7.61), GTM_BallGrippersMotorConnector (P1.3)
GPIO1: GTM_MCU (U7.54), GTM_FreePinsHeaders (P5.1)
GPIO2: GTM_MCU (U7.27), GTM_FreePinsHeaders (P5.2)
GPIO3: GTM_MCU (U7.26), GTM_FreePinsHeaders (P5.3)
GPIO4: GTM_MCU (U7.4), GTM_FreePinsHeaders (P5.4)
GPIO5: GTM_MCU (U7.3), GTM_FreePinsHeaders (P5.5)
GPIO6: GTM_MCU (U7.2), GTM_FreePinsHeaders (P5.6)
GPIO7: GTM_MCU (U7.20), GTM_FreePinsHeaders (P5.7)
I2C_SCL: GTM_MCU (U7.29), GTM_I2Cconnector (P6.1 P7.1 R43.1)
I2C_SDA: GTM_MCU (U7.30), GTM_I2Cconnector (P6.2 P7.2 R44.1)
NetC1_2: GTM_BallGrippersCircuits (R24.1 U4.5), GTM_BallGrippersFototransistorsConnectors (C1.2 T-1.5)
NetC2_2: GTM_BallGrippersCircuits (R36.1 U6.5), GTM_BallGrippersFototransistorsConnectors (C2.2 T-1.3)
NetC3_2: GTM_BallGrippersCircuits (R34.1 U6.3), GTM_BallGrippersFototransistorsConnectors (C3.2 T-1.1)
NetC4_2: GTM_BallGrippersCircuits (R12.1 U2.3), GTM_BallGrippersFototransistorsConnectors (C4.2 T-2.5)
NetC5_2: GTM_BallGrippersCircuits (R11.1 U2.5), GTM_BallGrippersFototransistorsConnectors (C5.2 T-2.3)
NetC6_2: GTM_BallGrippersCircuits (R23.1 U4.3), GTM_BallGrippersFototransistorsConnectors (C6.2 T-2.1)
NetC7_2: GTM_BallGrippersCircuits (R6.1 U1.3), GTM_BallGrippersFototransistorsConnectors (C7.2 T-3.5)
NetC8_2: GTM_BallGrippersCircuits (R17.1 U3.3), GTM_BallGrippersFototransistorsConnectors (C8.2 T-3.3)
NetC9_2: GTM_BallGrippersCircuits (R30.1 U5.5), GTM_BallGrippersFototransistorsConnectors (C9.2 T-3.1)
NetC10_2: GTM_BallGrippersCircuits (R5.1 U1.5), GTM_BallGrippersFototransistorsConnectors (C10.2 T-4.5)
NetC11_2: GTM_BallGrippersCircuits (R18.1 U3.5), GTM_BallGrippersFototransistorsConnectors (C11.2 T-4.3)
NetC12_2: GTM_BallGrippersCircuits (R28.1 U5.3), GTM_BallGrippersFototransistorsConnectors (C12.2 T-4.1)
NetR48_1: GTM_MCU (U7.37), GTM_MCUcontrolledLEDs (R48.1)
NetR49_1: GTM_MCU (U7.36), GTM_MCUcontrolledLEDs (R49.1)
NetR50_1: GTM_MCU (U7.35), GTM_MCUcontrolledLEDs (R50.1)
NetR51_1: GTM_MCU (U7.34), GTM_MCUcontrolledLEDs (R51.1)
NetR52_1: GTM_MCU (U7.33), GTM_MCUcontrolledLEDs (R52.1)
NRST: GTM_MCU (C15.2 R47.1 SW1.2 U7.7), GTM_ProgrammingConnector (P?.5)
Servo#1_PWM: GTM_MCU (U7.58), GTM_LeftJawGrippersMotorsConnectors (P8.3)
Servo#2_PWM: GTM_MCU (U7.59), GTM_RightJawGrippersMotorConnector (P12.3)
SPI_MISO: GTM_MCU (U7.22), GTM_SPIconnector (6 pins)
SPI_MOSI: GTM_MCU (U7.23), GTM_SPIconnector (P13.3 P14.3)
SPI_SCK: GTM_MCU (U7.21), GTM_SPIconnector (6 pins)
SWCLK: GTM_MCU (U7.49), GTM_ProgrammingConnector (P?.3)
SWDIO: GTM_MCU (U7.46), GTM_ProgrammingConnector (P?.2)
SWO: GTM_MCU (U7.55), GTM_ProgrammingConnector (P?.4)
Torpedo_PWM: GTM_MCU (U7.62), GTM_TorpedoModuleControlConnector (P15.3)
UART_CTS: GTM_MCU (U7.14), GTM_UARTconnector (P16.1 P17.1)
UART_RTS: GTM_MCU (U7.15), GTM_UARTconnector (P16.2 P17.2)
UART_RX: GTM_MCU (U7.17), GTM_UARTconnector (P16.4 P17.4)
UART_TX: GTM_MCU (U7.16), GTM_UARTconnector (P16.3 P17.3)